# EAGLE design Logic - Copy (EAGLE 6.4)

## Sheet 1 of 6: Power Supply
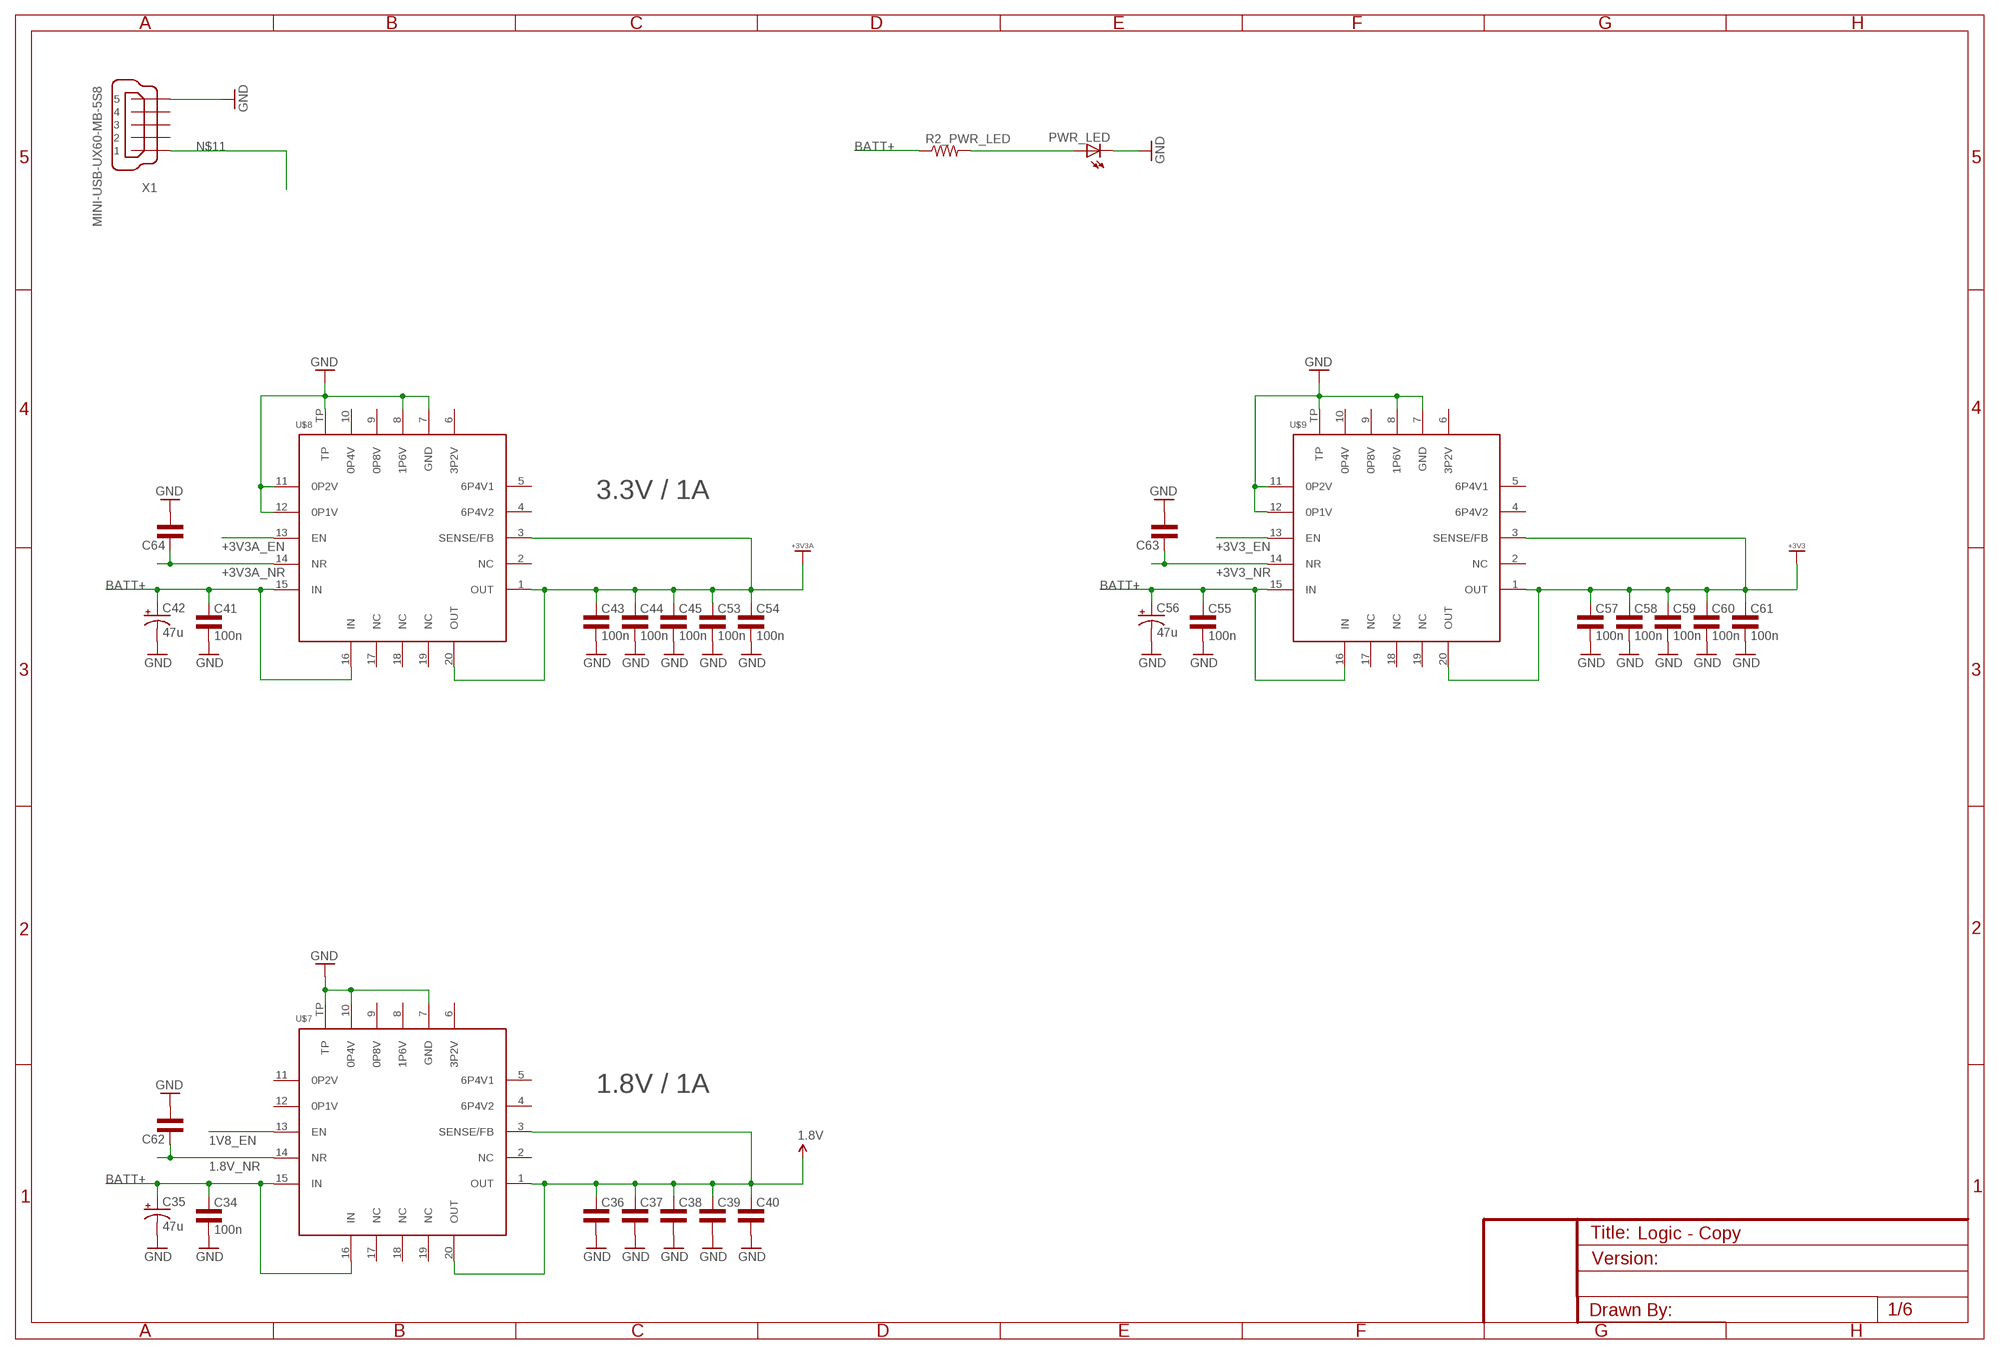
[diagram p0: schematic, sheet 1]

### Parts
C34  100n  CAP0805L3  [0805L3]
C35  47u  CPOL-USCT3528  [CT3528]
C36  CAP0805L3  [0805L3]
C37  CAP0805L3  [0805L3]
C38  CAP0805L3  [0805L3]
C39  CAP0805L3  [0805L3]
C40  CAP0805L3  [0805L3]
C41  100n  CAP0805L3  [0805L3]
C42  47u  CPOL-USCT3528  [CT3528]
C43  100n  CAP0805L3  [0805L3]
C44  100n  CAP0805L3  [0805L3]
C45  100n  CAP0805L3  [0805L3]
C53  100n  CAP0805L3  [0805L3]
C54  100n  CAP0805L3  [0805L3]
C55  100n  CAP0805L3  [0805L3]
C56  47u  CPOL-USCT3528  [CT3528]
C57  100n  CAP0805L3  [0805L3]
C58  100n  CAP0805L3  [0805L3]
C59  100n  CAP0805L3  [0805L3]
C60  100n  CAP0805L3  [0805L3]
C61  100n  CAP0805L3  [0805L3]
C62  CAP0402L3  [0402L3]
C63  CAP0402L3  [0402L3]
C64  CAP0402L3  [0402L3]
PWR_LED  LEDCHIP-LED0603  [CHIP-LED0603]
R2_PWR_LED  RESISTOR0402-RES  [0402-RES]
U$7  POWER-SUPPLY_POS_V1_TI_LDO_TPS7A4700  [POWER-SUPPLY_POS_V1_TI_LDO_VQFN-20]
U$8  POWER-SUPPLY_POS_V1_TI_LDO_TPS7A4700  [POWER-SUPPLY_POS_V1_TI_LDO_VQFN-20]
U$9  POWER-SUPPLY_POS_V1_TI_LDO_TPS7A4700  [POWER-SUPPLY_POS_V1_TI_LDO_VQFN-20]
X1  MINI-USB-UX60-MB-5S8  [UX60-MB-5S8]

### Nets
1.8V: C36.1 C37.1 C38.1 C39.1 C40.1 U$7.1(OUT) U$7.3(SENSE/FB) U$7.20(OUT) ; also sheet 6
1.8V_NR: C62.P$1 U$7.14(NR)
1V8_EN: U$7.13(EN)
+3V3: C57.1 C58.1 C59.1 C60.1 C61.1 U$9.1(OUT) U$9.3(SENSE/FB) U$9.20(OUT) ; also sheet 6
+3V3_EN: U$9.13(EN)
+3V3_NR: C63.P$1 U$9.14(NR)
+3V3A: C43.1 C44.1 C45.1 C53.1 C54.1 U$8.1(OUT) U$8.3(SENSE/FB) U$8.20(OUT) ; also sheet 6
+3V3A_EN: U$8.13(EN)
+3V3A_NR: C64.P$1 U$8.14(NR)
BATT+: C34.1 C35.+ C41.1 C42.+ C55.1 C56.+ R2_PWR_LED.1 U$7.15(IN) U$7.16(IN) U$8.15(IN) U$8.16(IN) U$9.15(IN) U$9.16(IN)
GND: C34.2 C35.- C36.2 C37.2 C38.2 C39.2 C40.2 C41.2 C42.- C43.2 C44.2 C45.2 C53.2 C54.2 C55.2 C56.- C57.2 C58.2 C59.2 C60.2 C61.2 C62.P$2 C63.P$2 C64.P$2 PWR_LED.C U$7.7(GND) U$7.10(0P4V) U$7.TP U$8.7(GND) U$8.8(1P6V) U$8.11(0P2V) U$8.12(0P1V) U$8.TP U$9.7(GND) U$9.8(1P6V) U$9.11(0P2V) U$9.12(0P1V) U$9.TP X1.5 ; also sheet 2,4,6
N$1: PWR_LED.A R2_PWR_LED.2
N$11: X1.1
Unconnected: U$7.2(NC) U$7.4(6P4V2) U$7.5(6P4V1) U$7.6(3P2V) U$7.8(1P6V) U$7.9(0P8V) U$7.11(0P2V) U$7.12(0P1V) U$7.17(NC) U$7.18(NC) U$7.19(NC) U$8.2(NC) U$8.4(6P4V2) U$8.5(6P4V1) U$8.6(3P2V) U$8.9(0P8V) U$8.10(0P4V) U$8.17(NC) U$8.18(NC) U$8.19(NC) U$9.2(NC) U$9.4(6P4V2) U$9.5(6P4V1) U$9.6(3P2V) U$9.9(0P8V) U$9.10(0P4V) U$9.17(NC) U$9.18(NC) U$9.19(NC) X1.2 X1.3 X1.4

### Notes on the sheet
- 3.3V / 1A
- 1.8V / 1A

## Sheet 2 of 6: STM32F439IIT
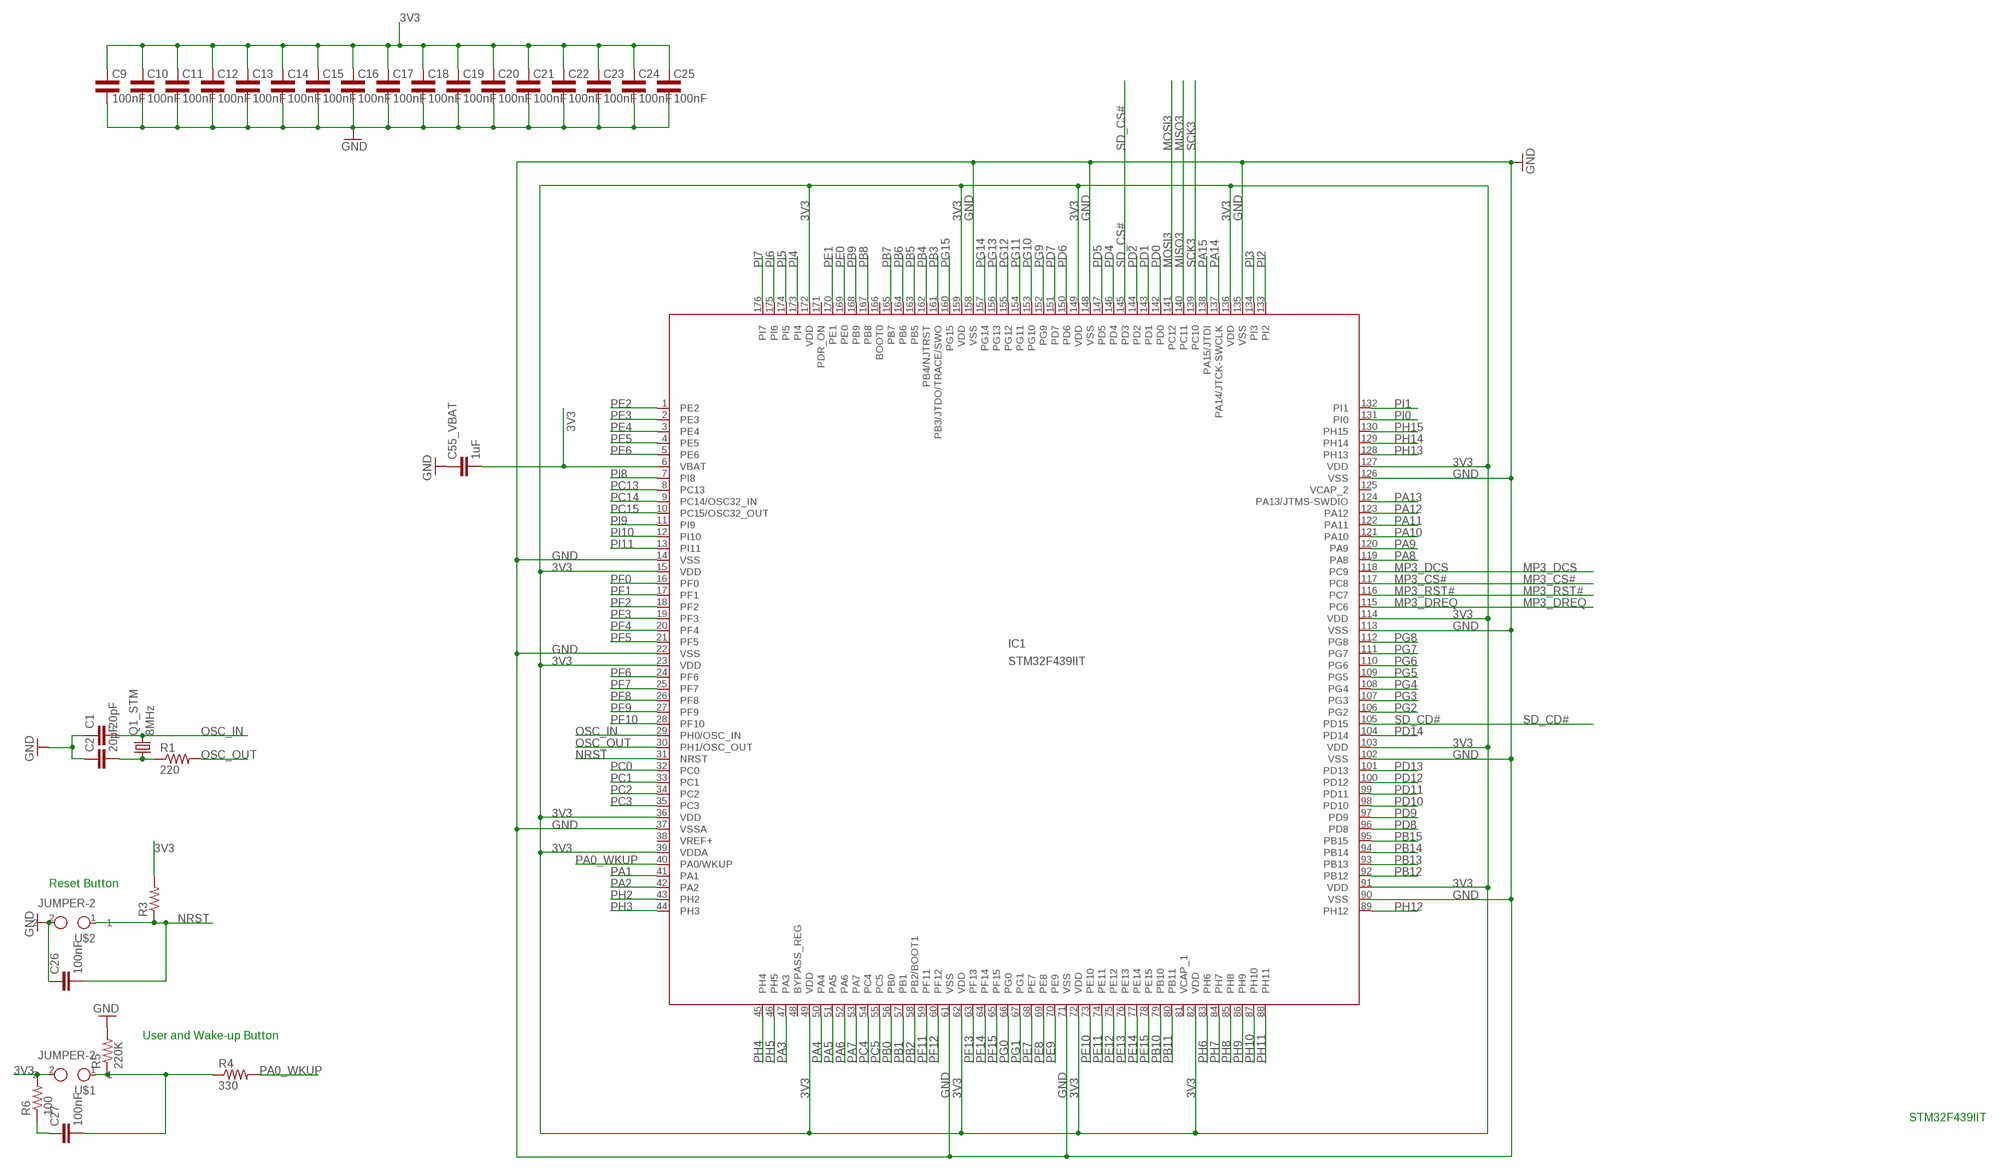
[diagram p1: schematic, sheet 2]

### Parts
C1  20pF  C-EUC0402  [C0402]
C2  20pF  C-EUC0402  [C0402]
C9  100nF  CAP0402L3  [0402L3]
C10  100nF  CAP0402L3  [0402L3]
C11  100nF  CAP0402L3  [0402L3]
C12  100nF  CAP0402L3  [0402L3]
C13  100nF  CAP0402L3  [0402L3]
C14  100nF  CAP0402L3  [0402L3]
C15  100nF  CAP0402L3  [0402L3]
C16  100nF  CAP0402L3  [0402L3]
C17  100nF  CAP0402L3  [0402L3]
C18  100nF  CAP0402L3  [0402L3]
C19  100nF  CAP0402L3  [0402L3]
C20  100nF  CAP0402L3  [0402L3]
C21  100nF  CAP0402L3  [0402L3]
C22  100nF  CAP0402L3  [0402L3]
C23  100nF  CAP0402L3  [0402L3]
C24  100nF  CAP0402L3  [0402L3]
C25  100nF  CAP0402L3  [0402L3]
C26  100nF  C-EUC0402  [C0402]
C27  100nF  C-EUC0402  [C0402]
C55_VBAT  1uF  C-EUC0402  [C0402]
IC1  STM32F439IIT  [LQFP-176]
Q1_STM  8MHz  CRYSTALCTS406  [CTS406]
R1  220  RESISTOR0402-RES  [0402-RES]
R3  RESISTOR0402-RES  [0402-RES]
R4  330  RESISTOR0402-RES  [0402-RES]
R5  220K  RESISTOR0402-RES  [0402-RES]
R6  100  RESISTOR0402-RES  [0402-RES]
U$1  JUMPER-2  [1X02]
U$2  JUMPER-2  [1X02]

### Nets
3V3: C9.P$1 C10.P$1 C11.P$1 C12.P$1 C13.P$1 C14.P$1 C15.P$1 C16.P$1 C17.P$1 C18.P$1 C19.P$1 C20.P$1 C21.P$1 C22.P$1 C23.P$1 C24.P$1 C25.P$1 C55_VBAT.2 IC1.6(VBAT) IC1.15(VDD) IC1.23(VDD) IC1.36(VDD) IC1.39(VDDA) IC1.49(VDD) IC1.62(VDD) IC1.72(VDD) IC1.82(VDD) IC1.91(VDD) IC1.103(VDD) IC1.114(VDD) IC1.127(VDD) IC1.136(VDD) IC1.149(VDD) IC1.159(VDD) IC1.172(VDD) R3.2 R6.2 U$1.2 ; also sheet 4
GND: C1.1 C2.1 C9.P$2 C10.P$2 C11.P$2 C12.P$2 C13.P$2 C14.P$2 C15.P$2 C16.P$2 C17.P$2 C18.P$2 C19.P$2 C20.P$2 C21.P$2 C22.P$2 C23.P$2 C24.P$2 C25.P$2 C26.1 C55_VBAT.1 IC1.14(VSS) IC1.22(VSS) IC1.37(VSSA) IC1.61(VSS) IC1.71(VSS) IC1.90(VSS) IC1.102(VSS) IC1.113(VSS) IC1.126(VSS) IC1.135(VSS) IC1.148(VSS) IC1.158(VSS) R5.2 U$2.2 ; also sheet 1,4,6
MISO3: IC1.140(PC11) ; also sheet 6
MOSI3: IC1.141(PC12) ; also sheet 6
MP3_CS#: IC1.117(PC8) ; also sheet 6
MP3_DCS: IC1.118(PC9) ; also sheet 6
MP3_DREQ: IC1.115(PC6) ; also sheet 6
MP3_RST#: IC1.116(PC7) ; also sheet 6
N$2: C2.2 Q1_STM.1 R1.1
N$3: C27.2 R4.1 R5.1 U$1.1
N$4: C27.1 R6.1
NRST: C26.2 IC1.31(NRST) R3.1 U$2.1
OSC_IN: C1.2 IC1.29(PH0/OSC_IN) Q1_STM.3
OSC_OUT: IC1.30(PH1/OSC_OUT) R1.2
PA0_WKUP: IC1.40(PA0/WKUP) R4.2
PA1: IC1.41(PA1)
PA2: IC1.42(PA2)
PA3: IC1.47(PA3)
PA4: IC1.50(PA4)
PA5: IC1.51(PA5)
PA6: IC1.52(PA6)
PA7: IC1.53(PA7)
PA8: IC1.119(PA8)
PA9: IC1.120(PA9)
PA10: IC1.121(PA10)
PA11: IC1.122(PA11)
PA12: IC1.123(PA12)
PA13: IC1.124(PA13/JTMS-SWDIO)
PA14: IC1.137(PA14/JTCK-SWCLK)
PA15: IC1.138(PA15/JTDI)
PB0: IC1.56(PB0)
PB1: IC1.57(PB1)
PB2: IC1.58(PB2/BOOT1)
PB3: IC1.161(PB3/JTDO/TRACE/SWO)
PB4: IC1.162(PB4/NJTRST)
PB5: IC1.163(PB5) ; also sheet 4
PB6: IC1.164(PB6) ; also sheet 4
PB7: IC1.165(PB7)
PB8: IC1.167(PB8)
PB9: IC1.168(PB9)
PB10: IC1.79(PB10)
PB11: IC1.80(PB11)
PB12: IC1.92(PB12)
PB13: IC1.93(PB13)
PB14: IC1.94(PB14)
PB15: IC1.95(PB15)
PC0: IC1.32(PC0) ; also sheet 4
PC1: IC1.33(PC1)
PC2: IC1.34(PC2)
PC3: IC1.35(PC3)
PC4: IC1.54(PC4)
PC5: IC1.55(PC5)
PC13: IC1.8(PC13)
PC14: IC1.9(PC14/OSC32_IN)
PC15: IC1.10(PC15/OSC32_OUT)
PD0: IC1.142(PD0) ; also sheet 4
PD1: IC1.143(PD1) ; also sheet 4
PD2: IC1.144(PD2)
PD4: IC1.146(PD4)
PD5: IC1.147(PD5)
PD6: IC1.150(PD6)
PD7: IC1.151(PD7)
PD8: IC1.96(PD8) ; also sheet 4
PD9: IC1.97(PD9) ; also sheet 4
PD10: IC1.98(PD10) ; also sheet 4
PD11: IC1.99(PD11)
PD12: IC1.100(PD12)
PD13: IC1.101(PD13)
PD14: IC1.104(PD14) ; also sheet 4
PE0: IC1.169(PE0) ; also sheet 4
PE1: IC1.170(PE1) ; also sheet 4
PE2: IC1.1(PE2)
PE3: IC1.2(PE3)
PE4: IC1.3(PE4)
PE5: IC1.4(PE5)
PE6: IC1.5(PE6)
PE7: IC1.68(PE7) ; also sheet 4
PE8: IC1.69(PE8) ; also sheet 4
PE9: IC1.70(PE9) ; also sheet 4
PE10: IC1.73(PE10) ; also sheet 4
PE11: IC1.74(PE11) ; also sheet 4
PE12: IC1.75(PE12) ; also sheet 4
PE13: IC1.76(PE13) ; also sheet 4
PE14: IC1.77(PE14) ; also sheet 4
PE15: IC1.78(PE15) ; also sheet 4
PF0: IC1.16(PF0) ; also sheet 4
PF1: IC1.17(PF1) ; also sheet 4
PF2: IC1.18(PF2) ; also sheet 4
PF3: IC1.19(PF3) ; also sheet 4
PF4: IC1.20(PF4) ; also sheet 4
PF5: IC1.21(PF5) ; also sheet 4
PF6: IC1.24(PF6)
PF7: IC1.25(PF7)
PF8: IC1.26(PF8)
PF9: IC1.27(PF9)
PF10: IC1.28(PF10)
PF11: IC1.59(PF11) ; also sheet 4
PF12: IC1.60(PF12) ; also sheet 4
PF13: IC1.63(PF13) ; also sheet 4
PF14: IC1.64(PF14) ; also sheet 4
PF15: IC1.65(PF15) ; also sheet 4
PG0: IC1.66(PG0) ; also sheet 4
PG1: IC1.67(PG1) ; also sheet 4
PG2: IC1.106(PG2)
PG3: IC1.107(PG3)
PG4: IC1.108(PG4) ; also sheet 4
PG5: IC1.109(PG5) ; also sheet 4
PG6: IC1.110(PG6)
PG7: IC1.111(PG7)
PG8: IC1.112(PG8) ; also sheet 4
PG9: IC1.152(PG9)
PG10: IC1.153(PG10)
PG11: IC1.154(PG11)
PG12: IC1.155(PG12)
PG13: IC1.156(PG13)
PG14: IC1.157(PG14)
PG15: IC1.160(PG15) ; also sheet 4
PH2: IC1.43(PH2)
PH3: IC1.44(PH3)
PH4: IC1.45(PH4)
PH5: IC1.46(PH5)
PH6: IC1.83(PH6)
PH7: IC1.84(PH7)
PH8: IC1.85(PH8)
PH9: IC1.86(PH9)
PH10: IC1.87(PH10)
PH11: IC1.88(PH11)
PH12: IC1.89(PH12)
PH13: IC1.128(PH13)
PH14: IC1.129(PH14)
PH15: IC1.130(PH15)
PI0: IC1.131(PI0)
PI1: IC1.132(PI1)
PI2: IC1.133(PI2)
PI3: IC1.134(PI3)
PI4: IC1.173(PI4)
PI5: IC1.174(PI5)
PI6: IC1.175(PI6)
PI7: IC1.176(PI7)
PI8: IC1.7(PI8)
PI9: IC1.11(PI9)
PI10: IC1.12(PI10)
PI11: IC1.13(PI11)
SCK3: IC1.139(PC10) ; also sheet 6
SD_CD#: IC1.105(PD15)
SD_CS#: IC1.145(PD3)
Unconnected: IC1.48(BYPASS_REG) IC1.166(BOOT0)

### Notes on the sheet
- Reset Button
- User and Wake-up Button
- STM32F439IIT

## Sheet 3 of 6: Header Pins
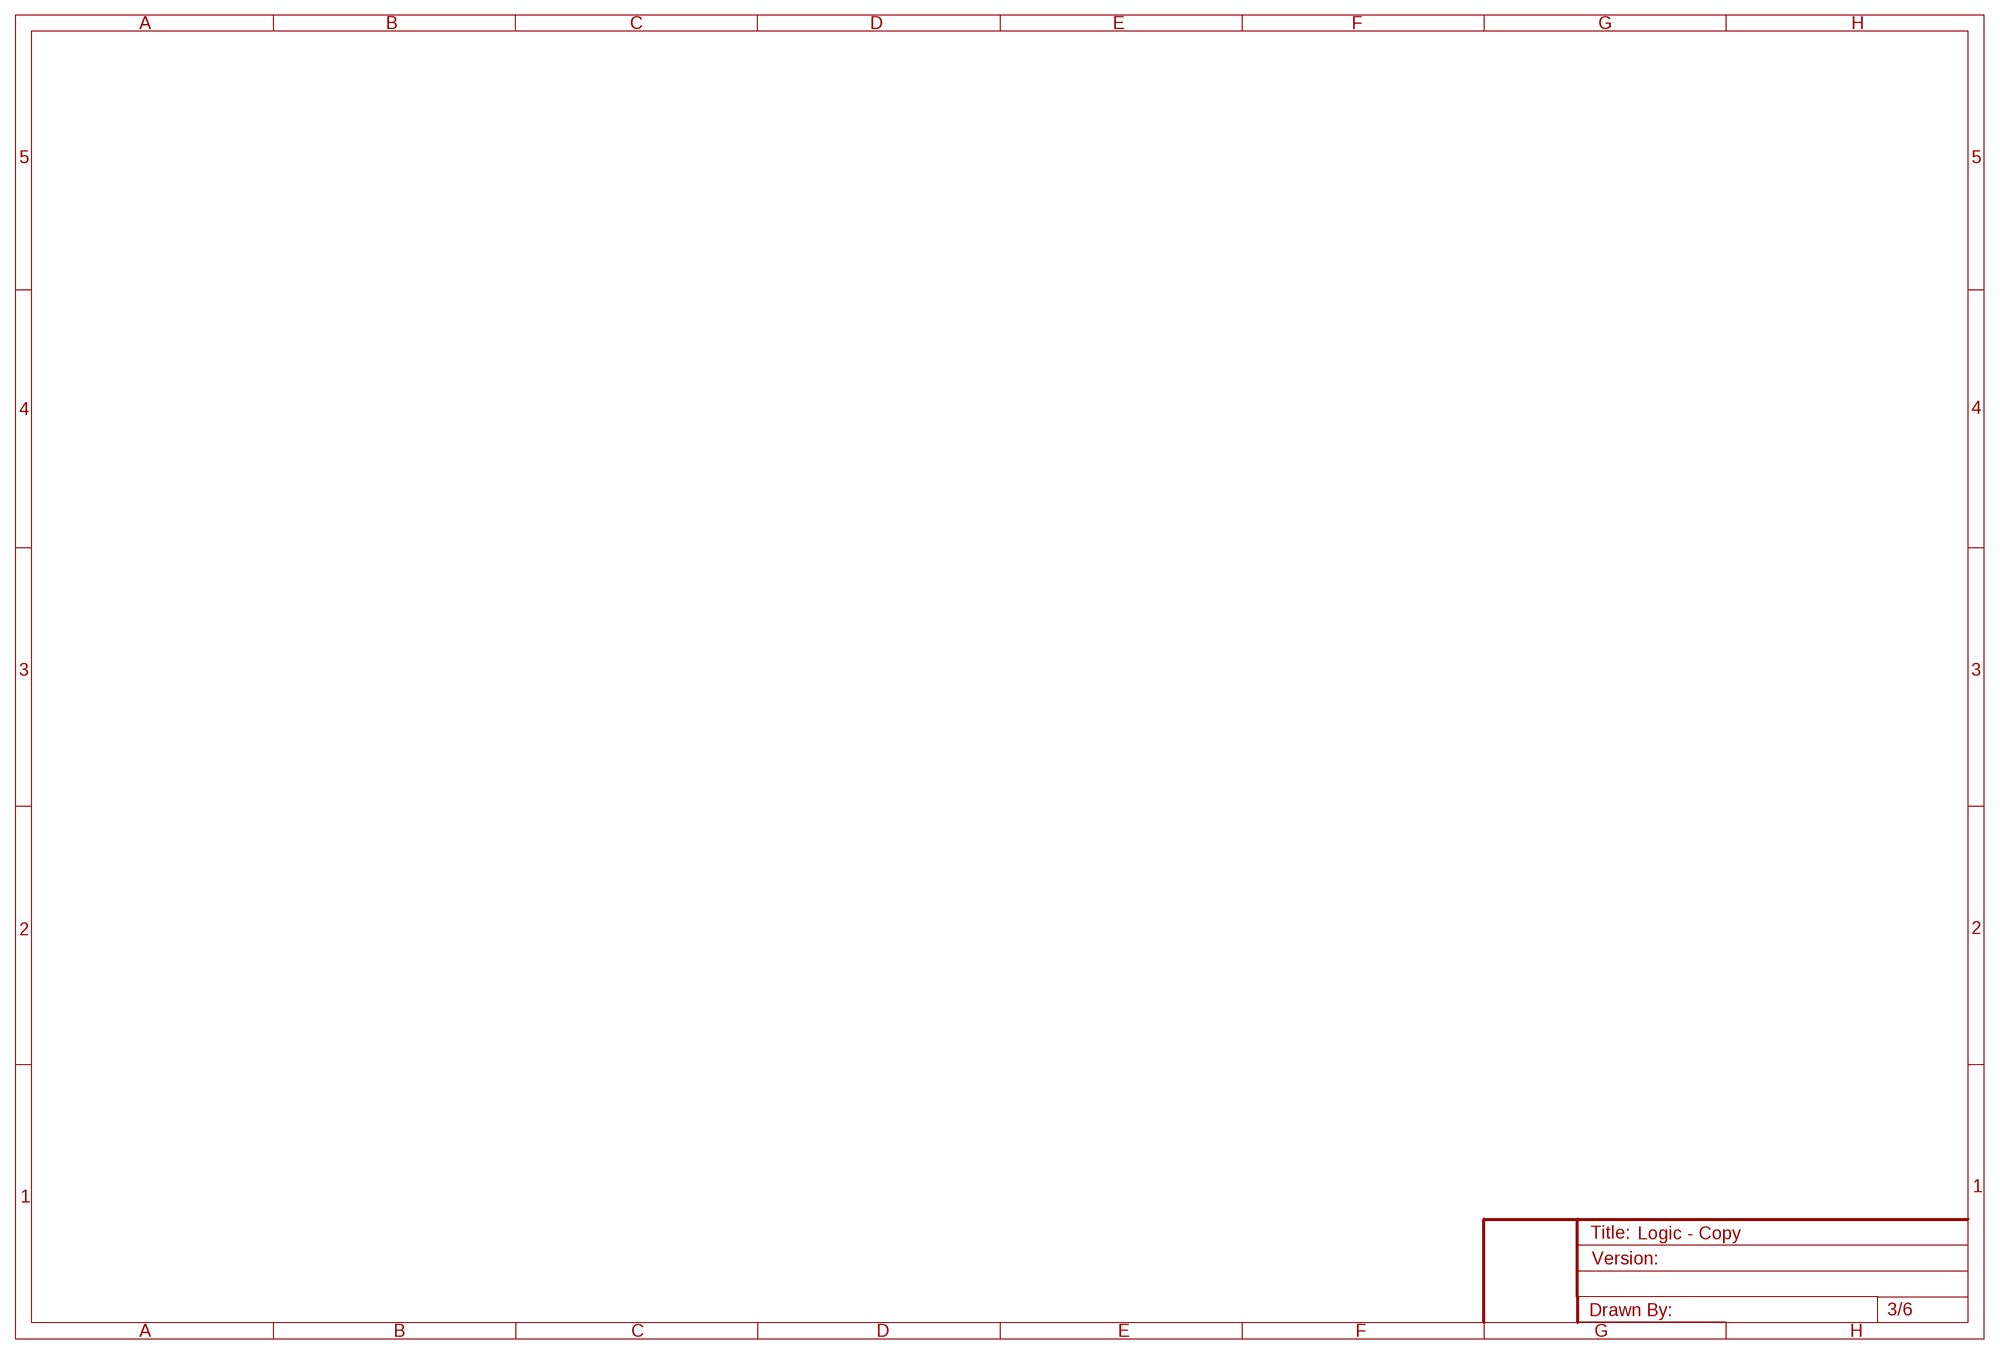
[diagram p2: schematic, sheet 3]

## Sheet 4 of 6: SRAM
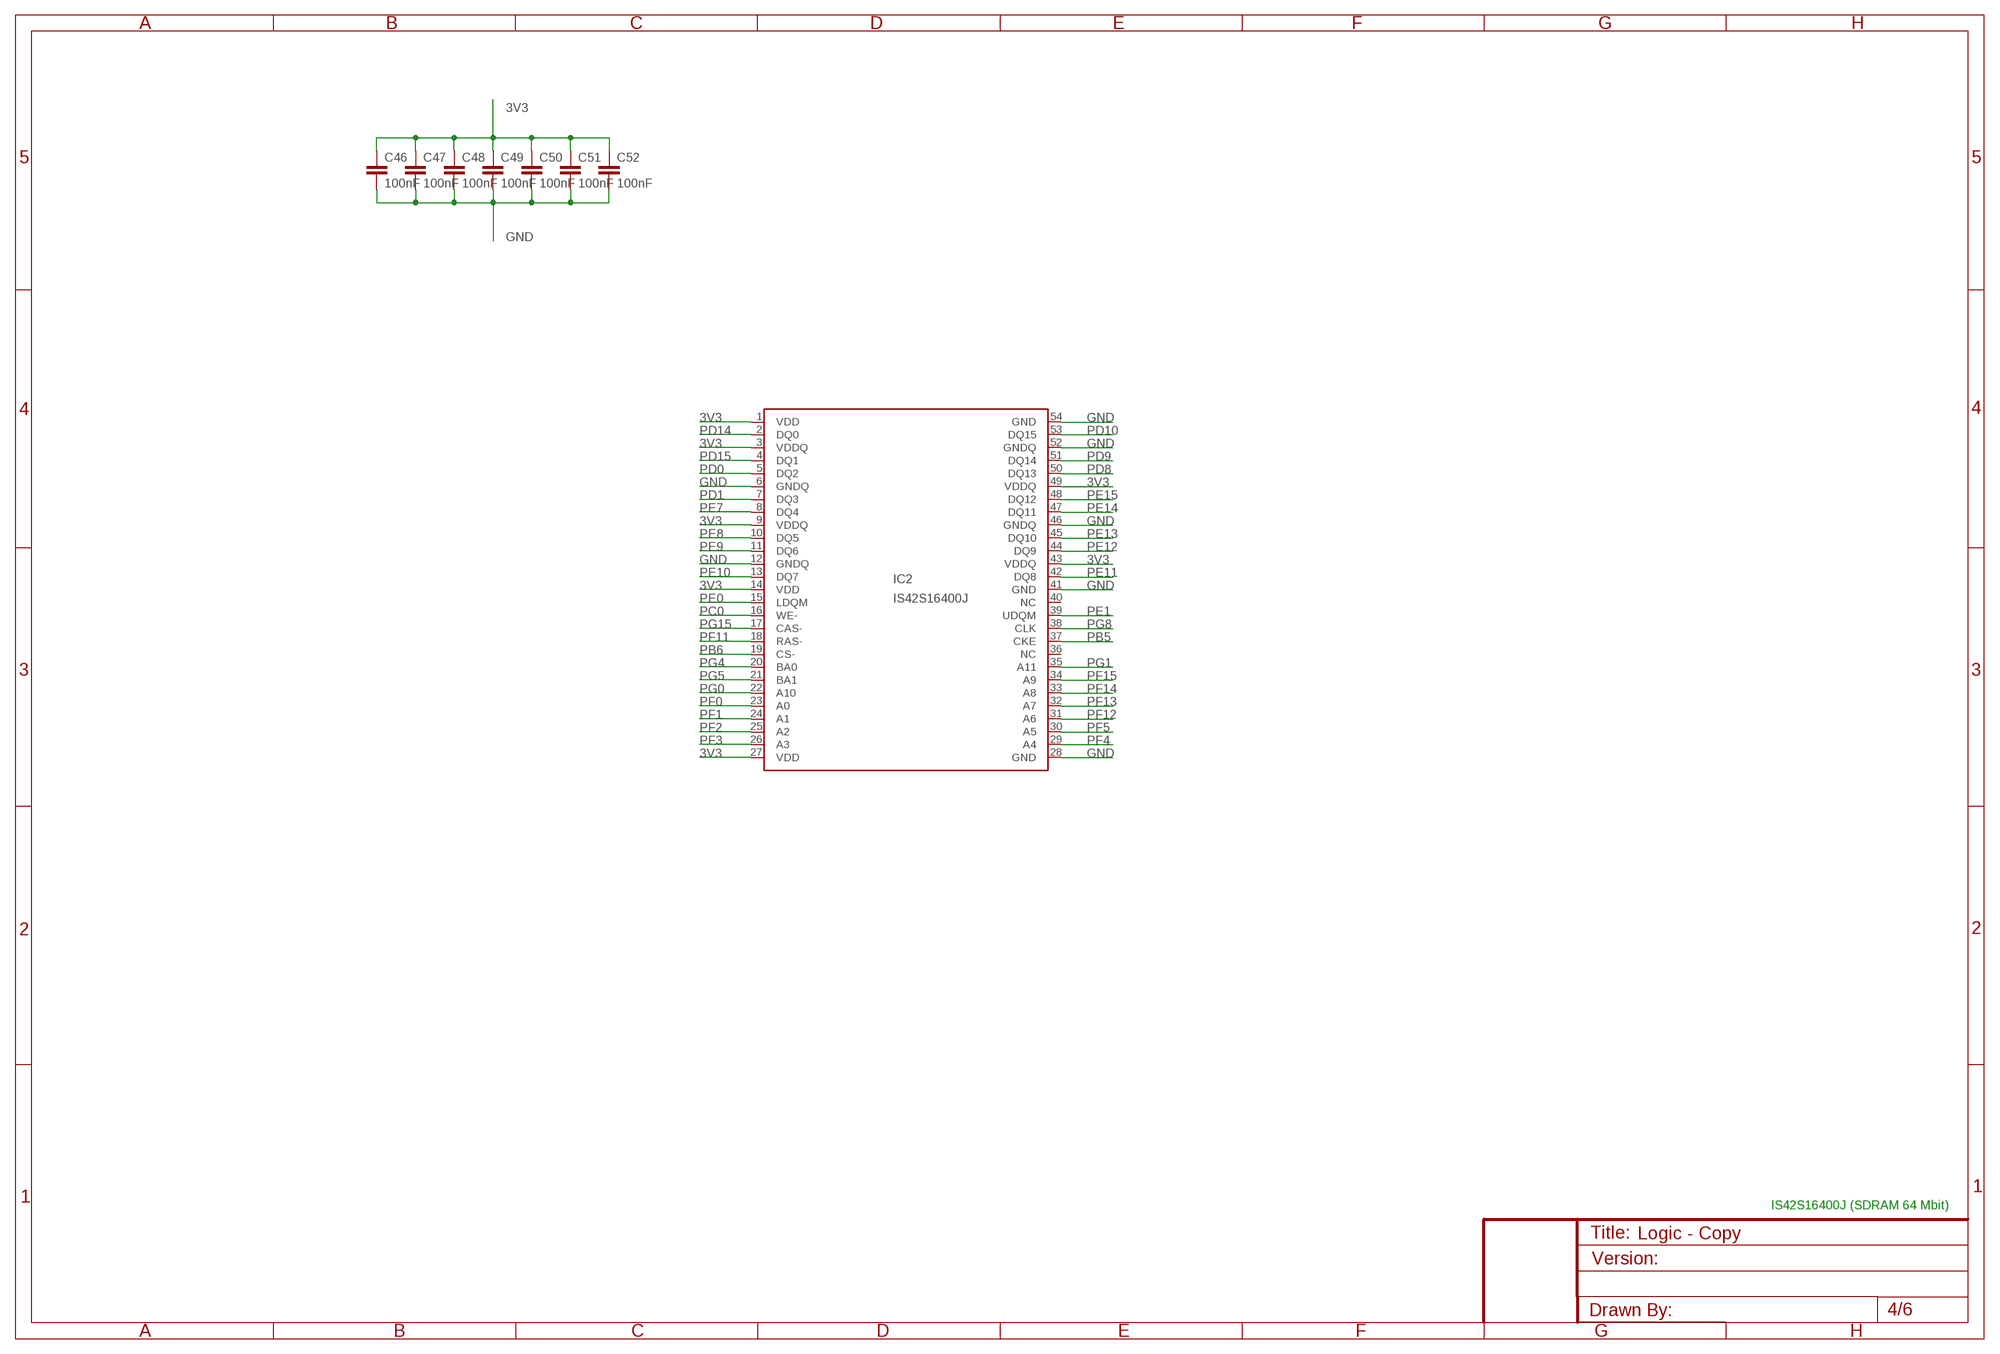
[diagram p3: schematic, sheet 4]

### Parts
C46  100nF  C-EUC0402  [C0402]
C47  100nF  C-EUC0402  [C0402]
C48  100nF  C-EUC0402  [C0402]
C49  100nF  C-EUC0402  [C0402]
C50  100nF  C-EUC0402  [C0402]
C51  100nF  C-EUC0402  [C0402]
C52  100nF  C-EUC0402  [C0402]
IC2  IS42S16400J  [TSOP-2]

### Nets
3V3: C46.1 C47.1 C48.1 C49.1 C50.1 C51.1 C52.1 IC2.1(VDD) IC2.3(VDDQ) IC2.9(VDDQ) IC2.14(VDD) IC2.27(VDD) IC2.43(VDDQ) IC2.49(VDDQ) ; also sheet 2
GND: C46.2 C47.2 C48.2 C49.2 C50.2 C51.2 C52.2 IC2.6(GNDQ) IC2.12(GNDQ) IC2.28(GND) IC2.41(GND) IC2.46(GNDQ) IC2.52(GNDQ) IC2.54(GND) ; also sheet 1,2,6
PB5: IC2.37(CKE) ; also sheet 2
PB6: IC2.19(CS-) ; also sheet 2
PC0: IC2.16(WE-) ; also sheet 2
PD0: IC2.5(DQ2) ; also sheet 2
PD1: IC2.7(DQ3) ; also sheet 2
PD8: IC2.50(DQ13) ; also sheet 2
PD9: IC2.51(DQ14) ; also sheet 2
PD10: IC2.53(DQ15) ; also sheet 2
PD14: IC2.2(DQ0) ; also sheet 2
PD15: IC2.4(DQ1)
PE0: IC2.15(LDQM) ; also sheet 2
PE1: IC2.39(UDQM) ; also sheet 2
PE7: IC2.8(DQ4) ; also sheet 2
PE8: IC2.10(DQ5) ; also sheet 2
PE9: IC2.11(DQ6) ; also sheet 2
PE10: IC2.13(DQ7) ; also sheet 2
PE11: IC2.42(DQ8) ; also sheet 2
PE12: IC2.44(DQ9) ; also sheet 2
PE13: IC2.45(DQ10) ; also sheet 2
PE14: IC2.47(DQ11) ; also sheet 2
PE15: IC2.48(DQ12) ; also sheet 2
PF0: IC2.23(A0) ; also sheet 2
PF1: IC2.24(A1) ; also sheet 2
PF2: IC2.25(A2) ; also sheet 2
PF3: IC2.26(A3) ; also sheet 2
PF4: IC2.29(A4) ; also sheet 2
PF5: IC2.30(A5) ; also sheet 2
PF11: IC2.18(RAS-) ; also sheet 2
PF12: IC2.31(A6) ; also sheet 2
PF13: IC2.32(A7) ; also sheet 2
PF14: IC2.33(A8) ; also sheet 2
PF15: IC2.34(A9) ; also sheet 2
PG0: IC2.22(A10) ; also sheet 2
PG1: IC2.35(A11) ; also sheet 2
PG4: IC2.20(BA0) ; also sheet 2
PG5: IC2.21(BA1) ; also sheet 2
PG8: IC2.38(CLK) ; also sheet 2
PG15: IC2.17(CAS-) ; also sheet 2
Unconnected: IC2.36(NC) IC2.40(NC)

### Notes on the sheet
- IS42S16400J (SDRAM 64 Mbit)

## Sheet 5 of 6: TFT & Touch
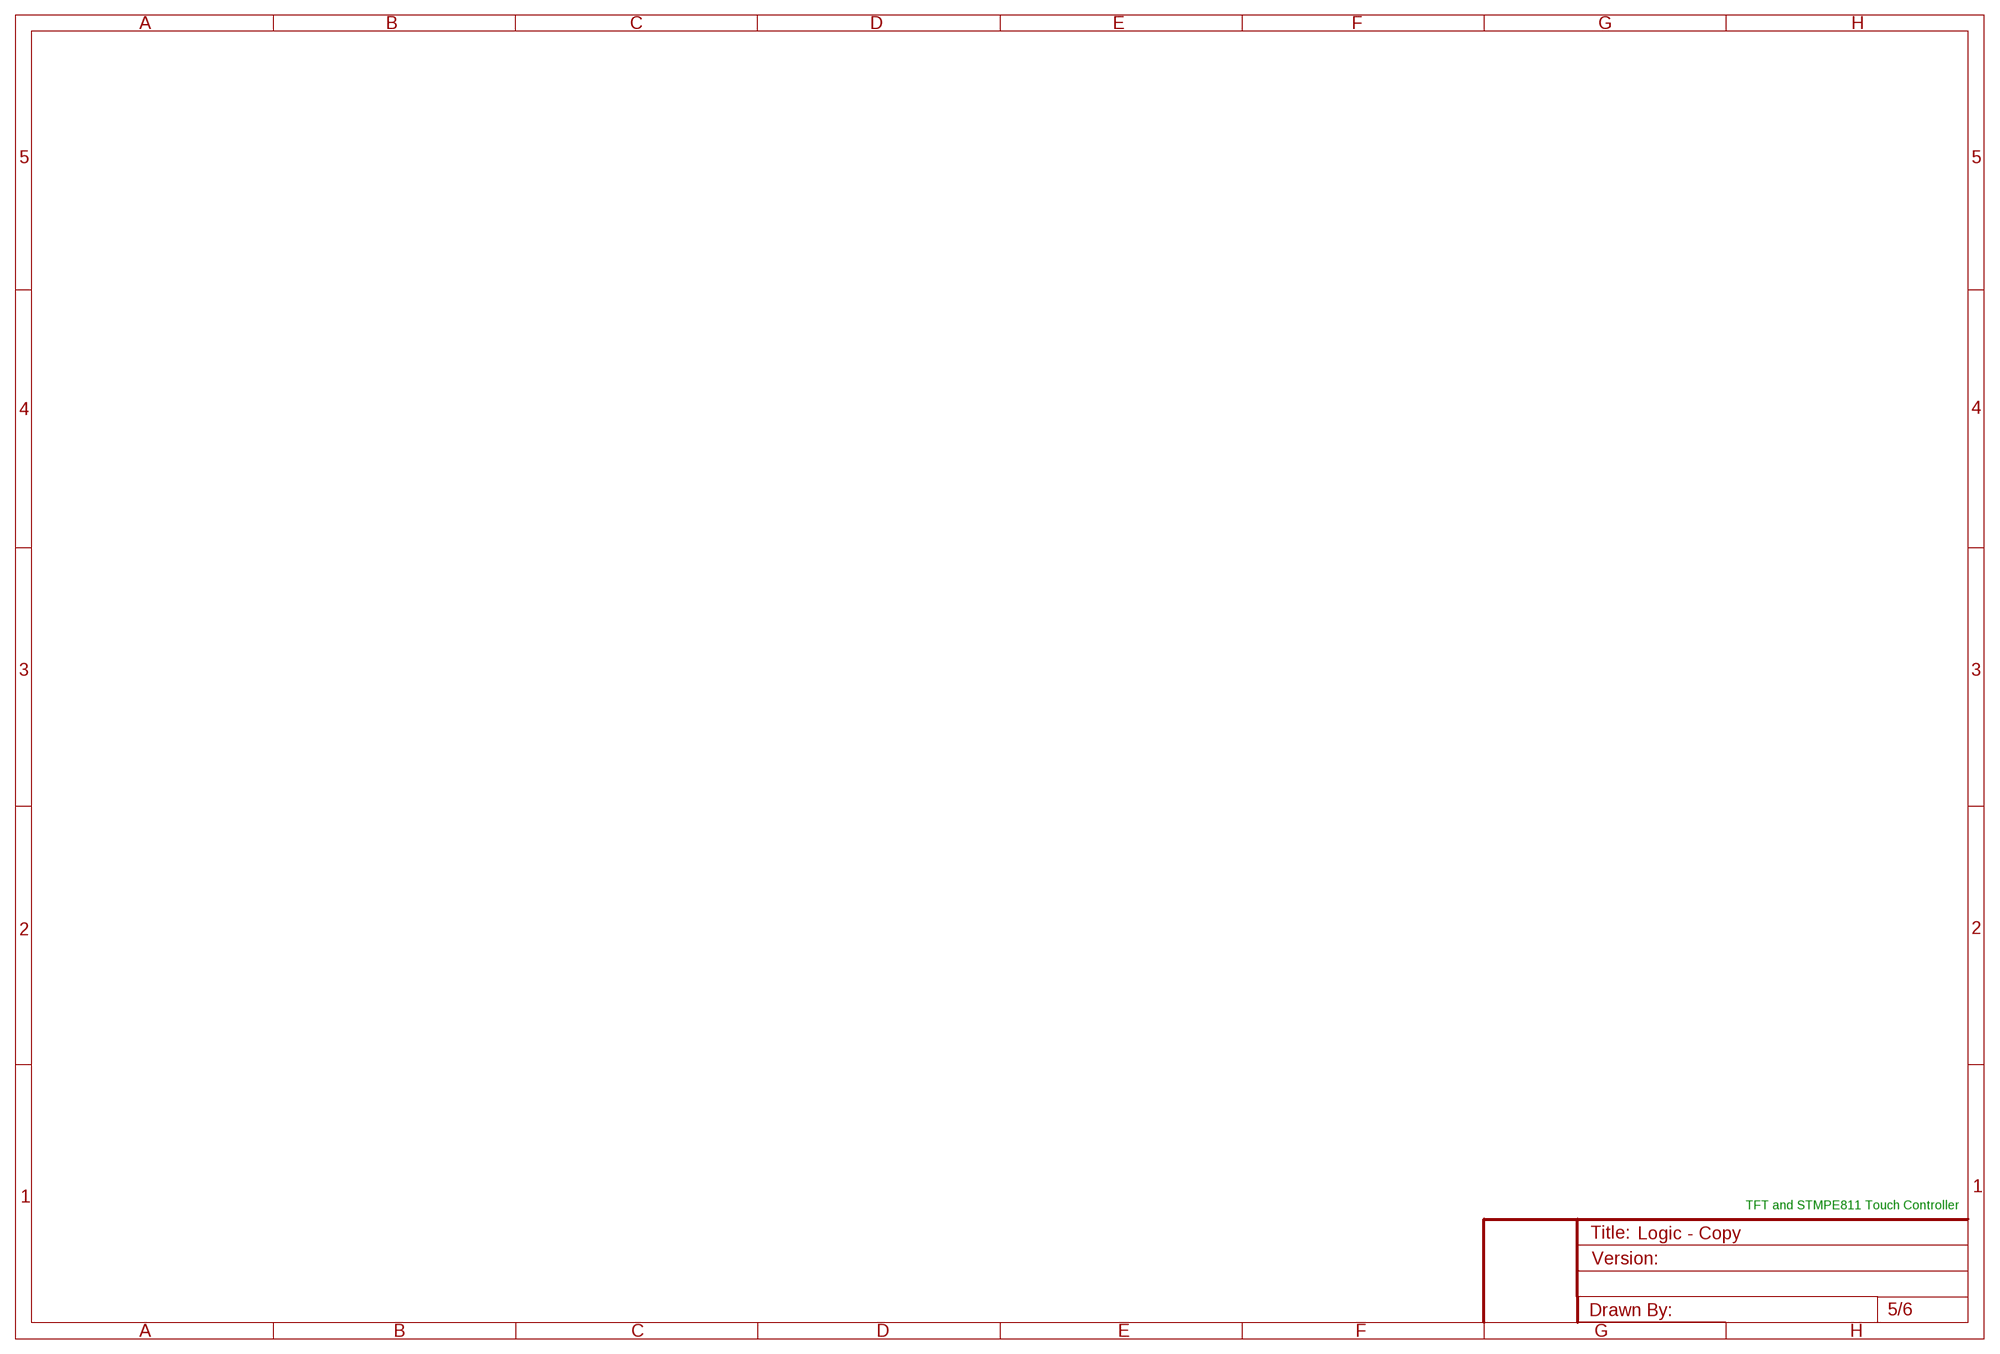
[diagram p4: schematic, sheet 5]

### Notes on the sheet
- TFT and STMPE811 Touch Controller

## Sheet 6 of 6: MP3 Codec
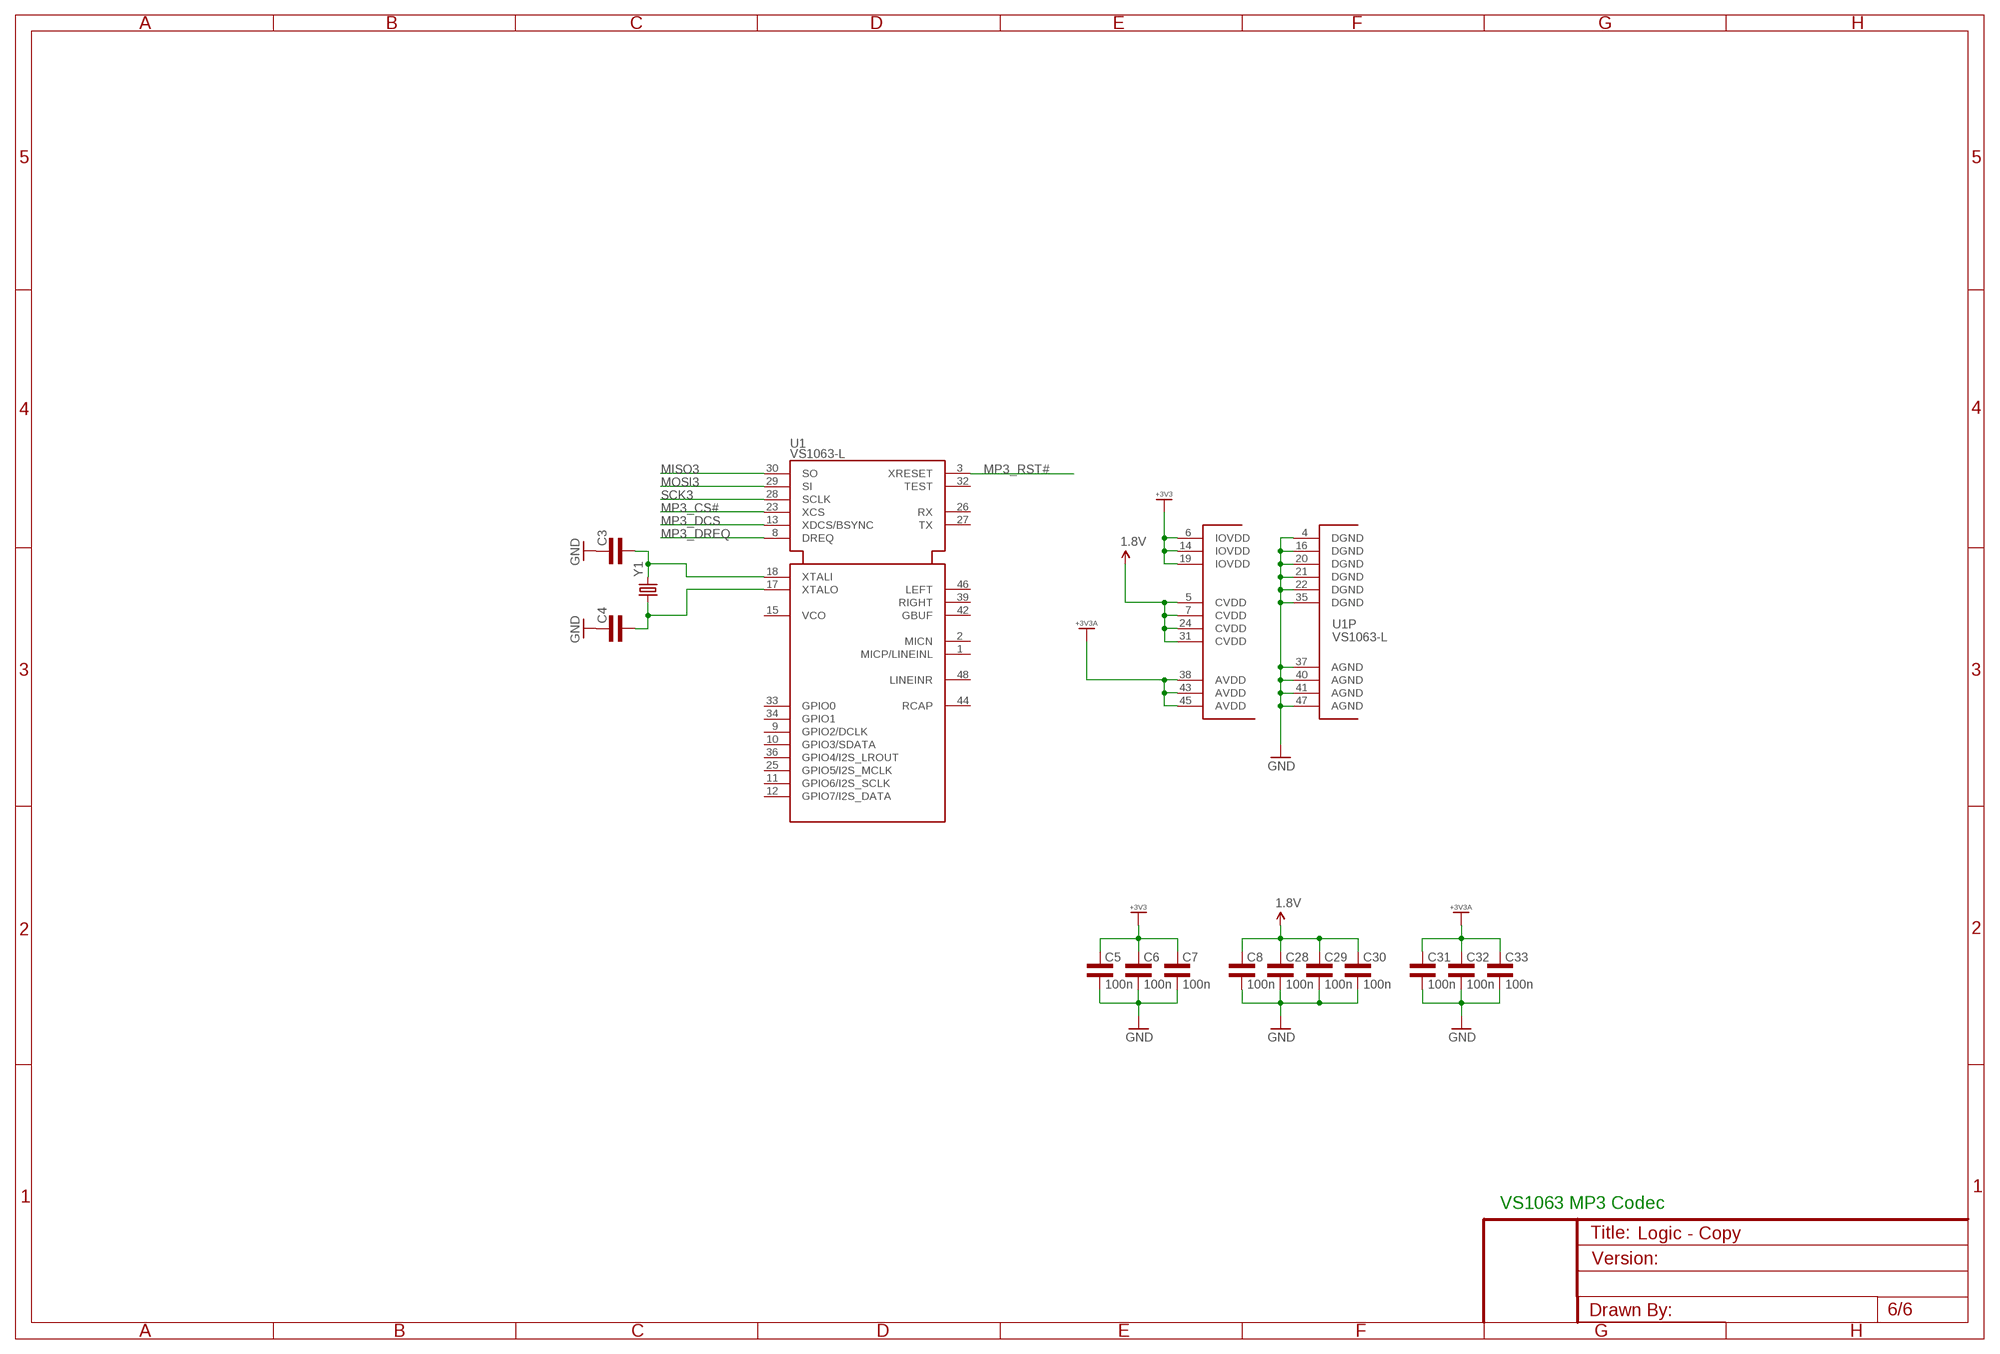
[diagram p5: schematic, sheet 6]

### Parts
C3  CAP0603L3  [0603L3]
C4  CAP0603L3  [0603L3]
C5  100n  CAP0402L3  [0402L3]
C6  100n  CAP0402L3  [0402L3]
C7  100n  CAP0402L3  [0402L3]
C8  100n  CAP0402L3  [0402L3]
C28  100n  CAP0402L3  [0402L3]
C29  100n  CAP0402L3  [0402L3]
C30  100n  CAP0402L3  [0402L3]
C31  100n  CAP0402L3  [0402L3]
C32  100n  CAP0402L3  [0402L3]
C33  100n  CAP0402L3  [0402L3]
U1  VS1063-L  [LQFP48]
Y1  CRYSTALHC49US  [HC49US]

### Nets
1.8V: C8.P$1 C28.P$1 C29.P$1 C30.P$1 U1.5(CVDD) U1.7(CVDD) U1.24(CVDD) U1.31(CVDD) ; also sheet 1
+3V3: C5.P$1 C6.P$1 C7.P$1 U1.6(IOVDD) U1.14(IOVDD) U1.19(IOVDD) ; also sheet 1
+3V3A: C31.P$1 C32.P$1 C33.P$1 U1.38(AVDD) U1.43(AVDD) U1.45(AVDD) ; also sheet 1
GND: C3.P$1 C4.P$1 C5.P$2 C6.P$2 C7.P$2 C8.P$2 C28.P$2 C29.P$2 C30.P$2 C31.P$2 C32.P$2 C33.P$2 U1.4(DGND) U1.16(DGND) U1.20(DGND) U1.21(DGND) U1.22(DGND) U1.35(DGND) U1.37(AGND) U1.40(AGND) U1.41(AGND) U1.47(AGND) ; also sheet 1,2,4
MISO3: U1.30(SO) ; also sheet 2
MOSI3: U1.29(SI) ; also sheet 2
MP3_CS#: U1.23(XCS) ; also sheet 2
MP3_DCS: U1.13(XDCS/BSYNC) ; also sheet 2
MP3_DREQ: U1.8(DREQ) ; also sheet 2
MP3_RST#: U1.3(XRESET) ; also sheet 2
N$5: C3.P$2 U1.18(XTALI) Y1.2
N$6: C4.P$2 U1.17(XTALO) Y1.1
SCK3: U1.28(SCLK) ; also sheet 2
Unconnected: U1.1(MICP/LINEINL) U1.2(MICN) U1.9(GPIO2/DCLK) U1.10(GPIO3/SDATA) U1.11(GPIO6/I2S_SCLK) U1.12(GPIO7/I2S_DATA) U1.15(VCO) U1.25(GPIO5/I2S_MCLK) U1.26(RX) U1.27(TX) U1.32(TEST) U1.33(GPIO0) U1.34(GPIO1) U1.36(GPIO4/I2S_LROUT) U1.39(RIGHT) U1.42(GBUF) U1.44(RCAP) U1.46(LEFT) U1.48(LINEINR)

### Notes on the sheet
- VS1063 MP3 Codec

## Power pins joined to a net without a drawn wire
PDR_ON: IC1.171(PDR_ON)
VCAP_1: IC1.81(VCAP_1)
VCAP_2: IC1.125(VCAP_2)
VREF+: IC1.38(VREF+)

## Library data of the parts
C1 C2 = resistor:C-EU: CAPACITOR, European symbol
C3-C25 C28-C34 C36-C41 C43-C45 C53-C55 C57-C64 = common:CAP
C26 C27 C46-C52 C55_VBAT = rcl:C-EU: CAPACITOR, European symbol
C35 C42 C56 = rcl:CPOL-US: POLARIZED CAPACITOR, American symbol
IC1 = STM32F439IIT:STM32F439IIT: edit this description Auto generated by make-symbol-device-package-bsdl.ulp Rev. 43 Source:
IC2 = IS42S16400J:IS42S16400J: edit this description Auto generated by make-symbol-device-package-bsdl.ulp Rev. 43 Source:
PWR_LED = led:LED: LED OSRAM: - CHIPLED LG R971, LG N971, LY N971, LG Q971, LY Q971, LO R971, LY R971 LH N974, LH R974 LS Q976, LO Q976, LY Q976 LO Q996 - Hyper CHIPLED LW Q18S LB Q993, LB Q99A, LB R99A - SideLED LS A670, LO A670, LY A670, LG A670, LP A670 LB A673, LV A673, LT A673, LW A673 LH A674 LY A675 LS A676, LA A676, LO A676, LY A676, LW A676 LS A679, LY A679, LG A679 - Hyper Micro SIDELED® LS Y876, LA Y876, LO Y876, LY Y876 LT Y87S - SmartLED LW L88C, LW L88S LB L89C, LB L89S, LG L890 LS L89K, LO L89K, LY L89K LS L896, LA L896, LO L896, LY L896 - TOPLED LS T670, LO T670, LY T670, LG T670, LP T670 LSG T670, LSP T670, LSY T670, LOP T670, LYG T670 LG T671, LOG T671, LSG T671 LB T673, LV T673, LT T673, LW T673 LH T674 LS T676, LA T676, LO T676, LY T676, LB T676, LH T676, LSB T676, LW T676 LB T67C, LV T67C, LT T67C, LS T67K, LO T67K, LY T67K, LW E67C LS E67B, LA E67B, LO E67B, LY E67B, LB E67C, LV E67C, LT E67C LW T67C LS T679, LY T679, LG T679 LS T770, LO T770, LY T770, LG T770, LP T770 LB T773, LV T773, LT T773, LW T773 LH T774 LS E675, LA E675, LY E675, LS T675 LS T776, LA T776, LO T776, LY T776, LB T776 LHGB T686 LT T68C, LB T68C - Hyper Mini TOPLED® LB M676 - Mini TOPLED Santana® LG M470 LS M47K, LO M47K, LY M47K Source: http://www.osram.convergy.de LUXEON: - LUMILED® LXK2-PW12-R00, LXK2-PW12-S00, LXK2-PW14-U00, LXK2-PW14-V00 LXK2-PM12-R00, LXK2-PM12-S00, LXK2-PM14-U00 LXK2-PE12-Q00, LXK2-PE12-R00, LXK2-PE12-S00, LXK2-PE14-T00, LXK2-PE14-U00 LXK2-PB12-K00, LXK2-PB12-L00, LXK2-PB12-M00, LXK2-PB14-N00, LXK2-PB14-P00, LXK2-PB14-Q00 LXK2-PR12-L00, LXK2-PR12-M00, LXK2-PR14-Q00, LXK2-PR14-R00 LXK2-PD12-Q00, LXK2-PD12-R00, LXK2-PD12-S00 LXK2-PH12-R00, LXK2-PH12-S00 LXK2-PL12-P00, LXK2-PL12-Q00, LXK2-PL12-R00 Source: www.luxeon.com KINGBRIGHT: KA-3528ASYC Source: www.kingbright.com
Q1_STM = crystal:CRYSTAL: CRYSTAL; OC_FARNELL: unknown; OC_NEWARK: unknown
R1 R2_PWR_LED R3-R6 = SparkFun-Passives:RESISTOR: Resistor Basic schematic elements and footprints for 0603, 1206, and PTH resistors.
U1 = vlsi-web:VS1063: MP3 / OGG / AAC / WMA / FLAC / G.711 / G.722 Audio Codec
U$1 U$2 = pinhead:JUMPER-2
U$7-U$9 = my_dac_amp:POWER-SUPPLY_POS_V1_TI_LDO_TPS7A4700
X1 = con-hirose:MINI-USB-: MINI USB Connector Source: http://www.hirose.co.jp/cataloge_hp/e24000019.pdf; OC_FARNELL: unknown; OC_NEWARK: unknown
Y1 = SparkFun-FreqCtrl:CRYSTAL: Various standard crystals. Proven footprints. Spark Fun Electronics SKU : COM-00534

## Board
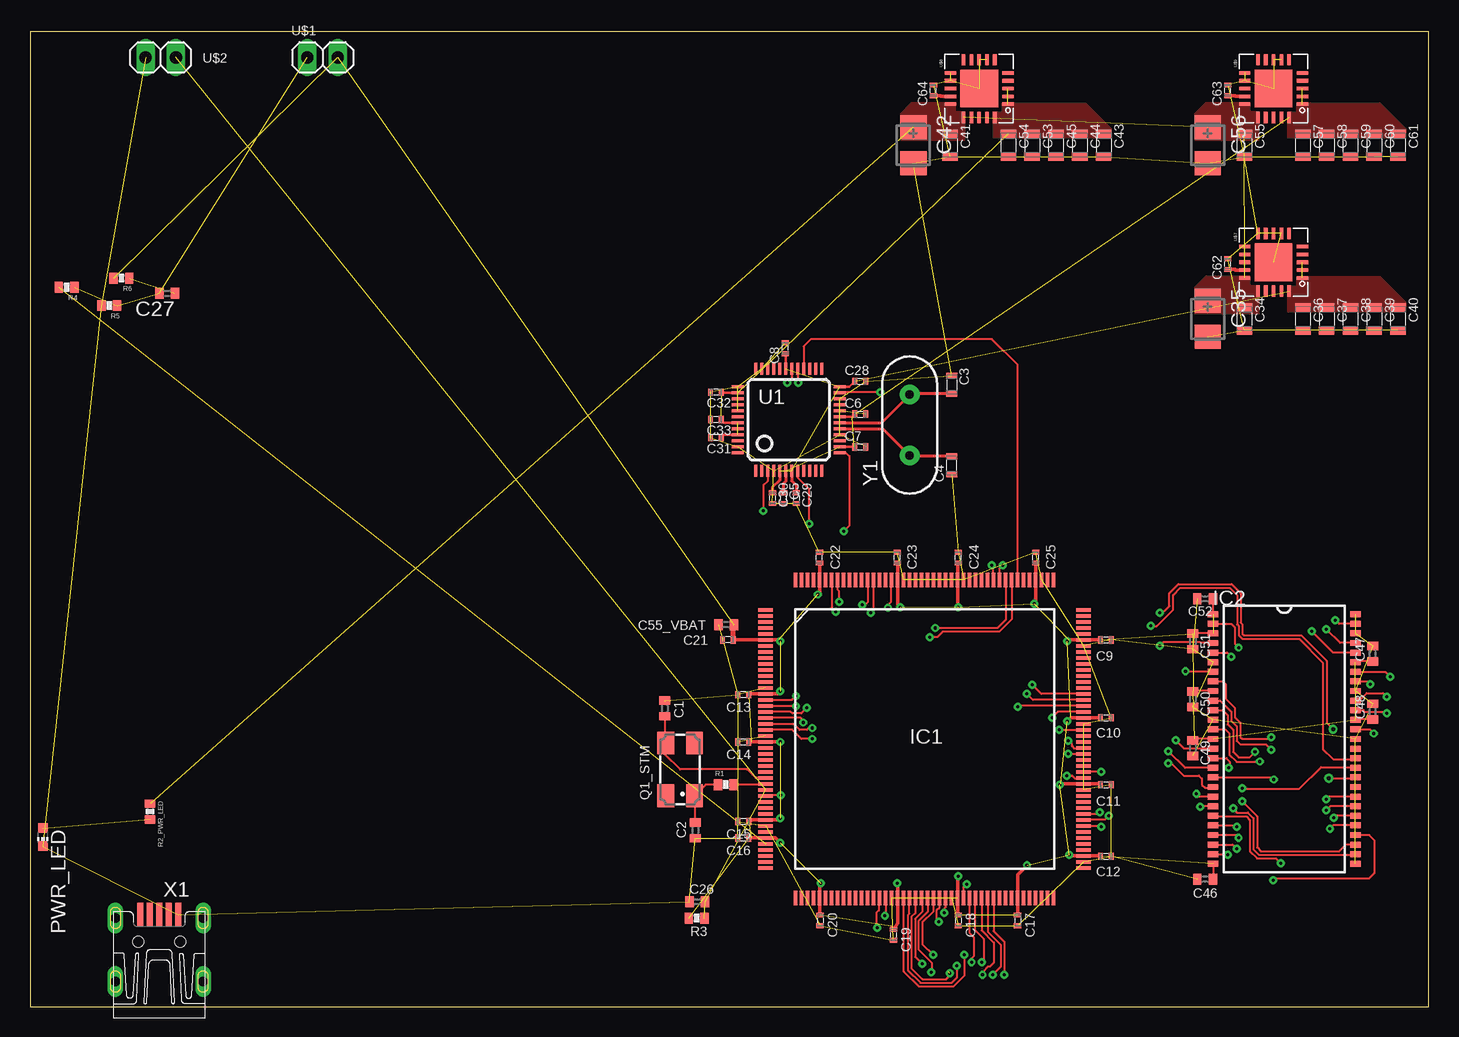
[diagram p6: board, top side]
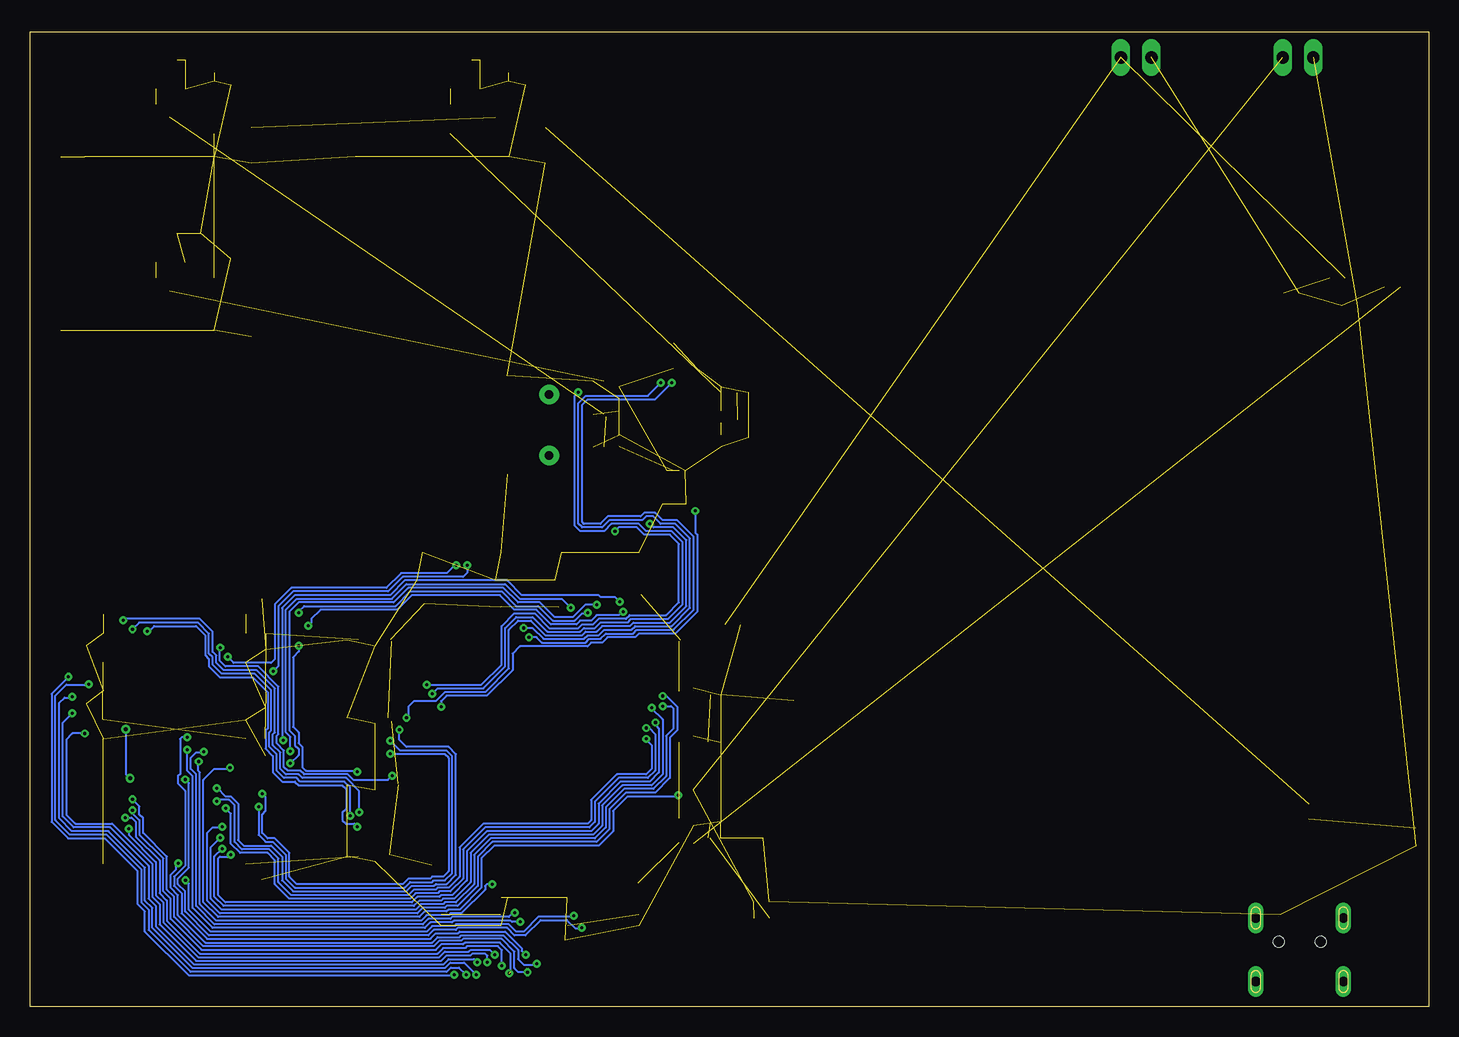
[diagram p7: board, bottom side, seen from below]

Size 116.57 x 81.23 mm. Coordinates in mm from the lower left corner, seen from the top.
Outline: 0,0 116.57,0 116.57,81.23 0,81.23 0,0
Copper layers (1*2*3*16): Top 0.035559375mm / dielectric 0.17018125mm / Route2 0.01778125mm / dielectric 47mil / Route3 0.01778125mm / dielectric 0.17018125mm / Bottom 0.035mm
Design rules "default *": minimum track width 6mil, minimum drill 10mil, track to track 6mil, track to pad 6mil, pad to pad 6mil, via to via 6mil, smd to smd 6mil, copper to edge 6mil, drill to drill 8mil, minimum pad ring 10mil, minimum via ring 8mil, stop-mask expansion 4mil, vias tented up to drill 11mil, thermal gap 10mil

### Footprints (pad centres in the part's own frame; a part is rotated, then mirrored left to right if it is on the bottom)
C0402 = smd 0.7 x 0.9: 1 -0.65,0; 2 0.65,0
0603L3 = smd 0.5 x 0.9: P$1 -0.75,0; P$2 0.75,0
0402L3 = smd 0.4 x 0.6: P$1 -0.45,0; P$2 0.45,0
0805L3 = smd 0.7 x 1.3: 1 -0.95,0; 2 0.95,0
CT3528 = smd 2 x 2.2: + -1.5,0; - 1.5,0
LQFP-176 = smd 1.2 x 0.3: 1 -13.25,10.75; 2 -13.25,10.25; 3 -13.25,9.75; 4 -13.25,9.25; 5 -13.25,8.75; 6 -13.25,8.25; 7 -13.25,7.75; 8 -13.25,7.25; 9 -13.25,6.75; 10 -13.25,6.25; 11 -13.25,5.75; 12 -13.25,5.25; 13 -13.25,4.75; 14 -13.25,4.25; 15 -13.25,3.75; 16 -13.25,3.25; 17 -13.25,2.75; 18 -13.25,2.25; 19 -13.25,1.75; 20 -13.25,1.25; 21 -13.25,0.75; 22 -13.25,0.25; 23 -13.25,-0.25; 24 -13.25,-0.75; 25 -13.25,-1.25; 26 -13.25,-1.75; 27 -13.25,-2.25; 28 -13.25,-2.75; 29 -13.25,-3.25; 30 -13.25,-3.75; 31 -13.25,-4.25; 32 -13.25,-4.75; 33 -13.25,-5.25; 34 -13.25,-5.75; 35 -13.25,-6.25; 36 -13.25,-6.75; 37 -13.25,-7.25; 38 -13.25,-7.75; 39 -13.25,-8.25; 40 -13.25,-8.75; 41 -13.25,-9.25; 42 -13.25,-9.75; 43 -13.25,-10.25; 44 -13.25,-10.75; 89 13.25,-10.75; 90 13.25,-10.25; 91 13.25,-9.75; 92 13.25,-9.25; 93 13.25,-8.75; 94 13.25,-8.25; 95 13.25,-7.75; 96 13.25,-7.25; 97 13.25,-6.75; 98 13.25,-6.25; 99 13.25,-5.75; 100 13.25,-5.25; 101 13.25,-4.75; 102 13.25,-4.25; 103 13.25,-3.75; 104 13.25,-3.25; 105 13.25,-2.75; 106 13.25,-2.25; 107 13.25,-1.75; 108 13.25,-1.25; 109 13.25,-0.75; 110 13.25,-0.25; 111 13.25,0.25; 112 13.25,0.75; 113 13.25,1.25; 114 13.25,1.75; 115 13.25,2.25; 116 13.25,2.75; 117 13.25,3.25; 118 13.25,3.75; 119 13.25,4.25; 120 13.25,4.75; 121 13.25,5.25; 122 13.25,5.75; 123 13.25,6.25; 124 13.25,6.75; 125 13.25,7.25; 126 13.25,7.75; 127 13.25,8.25; 128 13.25,8.75; 129 13.25,9.25; 130 13.25,9.75; 131 13.25,10.25; 132 13.25,10.75 | smd 0.3 x 1.2: 45 -10.75,-13.25; 46 -10.25,-13.25; 47 -9.75,-13.25; 48 -9.25,-13.25; 49 -8.75,-13.25; 50 -8.25,-13.25; 51 -7.75,-13.25; 52 -7.25,-13.25; 53 -6.75,-13.25; 54 -6.25,-13.25; 55 -5.75,-13.25; 56 -5.25,-13.25; 57 -4.75,-13.25; 58 -4.25,-13.25; 59 -3.75,-13.25; 60 -3.25,-13.25; 61 -2.75,-13.25; 62 -2.25,-13.25; 63 -1.75,-13.25; 64 -1.25,-13.25; 65 -0.75,-13.25; 66 -0.25,-13.25; 67 0.25,-13.25; 68 0.75,-13.25; 69 1.25,-13.25; 70 1.75,-13.25; 71 2.25,-13.25; 72 2.75,-13.25; 73 3.25,-13.25; 74 3.75,-13.25; 75 4.25,-13.25; 76 4.75,-13.25; 77 5.25,-13.25; 78 5.75,-13.25; 79 6.25,-13.25; 80 6.75,-13.25; 81 7.25,-13.25; 82 7.75,-13.25; 83 8.25,-13.25; 84 8.75,-13.25; 85 9.25,-13.25; 86 9.75,-13.25; 87 10.25,-13.25; 88 10.75,-13.25; 133 10.75,13.25; 134 10.25,13.25; 135 9.75,13.25; 136 9.25,13.25; 137 8.75,13.25; 138 8.25,13.25; 139 7.75,13.25; 140 7.25,13.25; 141 6.75,13.25; 142 6.25,13.25; 143 5.75,13.25; 144 5.25,13.25; 145 4.75,13.25; 146 4.25,13.25; 147 3.75,13.25; 148 3.25,13.25; 149 2.75,13.25; 150 2.25,13.25; 151 1.75,13.25; 152 1.25,13.25; 153 0.75,13.25; 154 0.25,13.25; 155 -0.25,13.25; 156 -0.75,13.25; 157 -1.25,13.25; 158 -1.75,13.25; 159 -2.25,13.25; 160 -2.75,13.25; 161 -3.25,13.25; 162 -3.75,13.25; 163 -4.25,13.25; 164 -4.75,13.25; 165 -5.25,13.25; 166 -5.75,13.25; 167 -6.25,13.25; 168 -6.75,13.25; 169 -7.25,13.25; 170 -7.75,13.25; 171 -8.25,13.25; 172 -8.75,13.25; 173 -9.25,13.25; 174 -9.75,13.25; 175 -10.25,13.25; 176 -10.75,13.25
TSOP-2 = smd 0.9 x 0.49: 1 -5.93,10.4; 2 -5.93,9.6; 3 -5.93,8.8; 4 -5.93,8; 5 -5.93,7.2; 6 -5.93,6.4; 7 -5.93,5.6; 8 -5.93,4.8; 9 -5.93,4; 10 -5.93,3.2; 11 -5.93,2.4; 12 -5.93,1.6; 13 -5.93,0.8; 14 -5.93,0; 15 -5.93,-0.8; 16 -5.93,-1.6; 17 -5.93,-2.4; 18 -5.93,-3.2; 19 -5.93,-4; 20 -5.93,-4.8; 21 -5.93,-5.6; 22 -5.93,-6.4; 23 -5.93,-7.2; 24 -5.93,-8; 25 -5.93,-8.8; 26 -5.93,-9.6; 27 -5.93,-10.4; 28 5.93,-10.4; 29 5.93,-9.6; 30 5.93,-8.8; 31 5.93,-8; 32 5.93,-7.2; 33 5.93,-6.4; 34 5.93,-5.6; 35 5.93,-4.8; 36 5.93,-4; 37 5.93,-3.2; 38 5.93,-2.4; 39 5.93,-1.6; 40 5.93,-0.8; 41 5.93,0; 42 5.93,0.8; 43 5.93,1.6; 44 5.93,2.4; 45 5.93,3.2; 46 5.93,4; 47 5.93,4.8; 48 5.93,5.6; 49 5.93,6.4; 50 5.93,7.2; 51 5.93,8; 52 5.93,8.8; 53 5.93,9.6; 54 5.93,10.4
CHIP-LED0603 = smd 0.8 x 0.8: A 0,-0.75; C 0,0.75
CTS406 = smd 1.9 x 1.4: 1 -2.2,-1.2; 2 2.2,-1.2; 3 2.2,1.2; 4 -2.2,1.2
0402-RES = smd 0.7 x 0.9: 1 -0.65,0; 2 0.65,0
LQFP48 = smd 0.25 x 1: 1 -2.75,-4.25; 2 -2.25,-4.25; 3 -1.75,-4.25; 4 -1.25,-4.25; 5 -0.75,-4.25; 6 -0.25,-4.25; 7 0.25,-4.25; 8 0.75,-4.25; 9 1.25,-4.25; 10 1.75,-4.25; 11 2.25,-4.25; 12 2.75,-4.25; 25 2.75,4.25; 26 2.25,4.25; 27 1.75,4.25; 28 1.25,4.25; 29 0.75,4.25; 30 0.25,4.25; 31 -0.25,4.25; 32 -0.75,4.25; 33 -1.25,4.25; 34 -1.75,4.25; 35 -2.25,4.25; 36 -2.75,4.25 | smd 1 x 0.25: 13 4.25,-2.75; 14 4.25,-2.25; 15 4.25,-1.75; 16 4.25,-1.25; 17 4.25,-0.75; 18 4.25,-0.25; 19 4.25,0.25; 20 4.25,0.75; 21 4.25,1.25; 22 4.25,1.75; 23 4.25,2.25; 24 4.25,2.75; 37 -4.25,2.75; 38 -4.25,2.25; 39 -4.25,1.75; 40 -4.25,1.25; 41 -4.25,0.75; 42 -4.25,0.25; 43 -4.25,-0.25; 44 -4.25,-0.75; 45 -4.25,-1.25; 46 -4.25,-1.75; 47 -4.25,-2.25; 48 -4.25,-2.75
1X02 = drill 1.016 long: 1 -1.27,0; 2 1.27,0
POWER-SUPPLY_POS_V1_TI_LDO_VQFN-20 = smd 0.3 x 0.95: 1 -1.3,-2.4; 2 -0.65,-2.4; 3 0,-2.4; 4 0.65,-2.4; 5 1.3,-2.4; 11 1.3,2.4; 12 0.65,2.4; 13 0,2.4; 14 -0.65,2.4; 15 -1.3,2.4 | smd 0.95 x 0.3: 6 2.4,-1.3; 7 2.4,-0.65; 8 2.4,0; 9 2.4,0.65; 10 2.4,1.3; 16 -2.4,1.3; 17 -2.4,0.65; 18 -2.4,0; 19 -2.4,-0.65; 20 -2.4,-1.3 | smd 3.15 x 3.15: TP 0,0
UX60-MB-5S8 = smd 2 x 0.5: 1 8.65,1.6; 2 8.65,0.8; 3 8.65,0; 4 8.65,-0.8; 5 8.65,-1.6 | drill 0.8 long: M1 3.1,-3.65; M2 3.1,3.65; M3 8.4,3.65; M4 8.4,-3.65 | hole 0.9: 6.4,-1.75; 6.4,1.75
HC49US = drill 0.7 pad 1.651: 1 -2.54,0; 2 2.54,0

### Placement (x,y rotation side)
C1  52.91,24.84 270 top
C2  55.45,14.68 90 top
C3  76.81,51.82 270 top
C4  76.81,45.11 90 top
C5  62.79,42.37 270 top
C6  69.19,49.38 0 top
C7  69.19,46.63 0 top
C8  62.94,54.86 90 top
C9  89.66,30.56 0 top
C10  89.66,24.08 0 top
C11  89.66,18.49 0 top
C12  89.66,12.52 0 top
C13  59.44,25.98 180 top
C14  59.44,22.05 180 top
C15  59.44,15.42 180 top
C16  59.44,14.05 180 top
C17  82.3,7.19 270 top
C18  77.34,7.19 270 top
C19  71.96,5.97 270 top
C20  65.84,7.19 270 top
C21  58.17,30.56 180 top
C22  65.79,37.41 90 top
C23  72.26,37.41 90 top
C24  77.34,37.41 90 top
C25  83.82,37.41 90 top
C26  55.6,8.74 0 top
C27  11.43,59.44 180 top
C28  69.19,52.12 0 top
C29  63.86,42.37 270 top
C30  61.87,42.37 270 top
C31  57.15,47.4 180 top
C32  57.15,51.21 180 top
C33  57.15,48.92 180 top
C34  101.19,57.3 270 top
C35  98.15,57.3 270 top
C36  106.07,57.3 270 top
C37  108.05,57.3 270 top
C38  110.03,57.3 270 top
C39  112.01,57.3 270 top
C40  114,57.3 270 top
C41  76.66,71.78 270 top
C42  73.61,71.78 270 top
C43  89.46,71.78 270 top
C44  87.48,71.78 270 top
C45  85.5,71.78 270 top
C46  97.92,10.62 180 top
C47  111.89,29.41 90 top
C48  111.89,24.59 90 top
C49  96.9,21.54 270 top
C50  96.9,25.6 270 top
C51  96.9,30.43 270 top
C52  97.92,33.99 180 top
C53  83.52,71.78 270 top
C54  81.53,71.78 270 top
C55  101.19,71.78 270 top
C55_VBAT  58.01,31.83 0 top
C56  98.15,71.78 270 top
C57  106.07,71.78 270 top
C58  108.05,71.78 270 top
C59  110.03,71.78 270 top
C60  112.01,71.78 270 top
C61  114,71.78 270 top
C62  99.82,61.87 90 top
C63  99.82,76.35 90 top
C64  75.29,76.35 90 top
IC1  74.55,22.3 0 top
IC2  104.52,22.3 0 top
PWR_LED  1.07,14.12 180 top
Q1_STM  54.18,19.76 90 top
R1  57.99,18.49 0 top
R2_PWR_LED  10.01,16.26 270 top
R3  55.55,7.37 180 top
R4  3.05,59.94 180 top
R5  6.6,58.42 180 top
R6  7.62,60.71 180 top
U1  63.22,48.92 0 top
U$1  24.38,79.1 0 top
U$2  10.9,79.1 180 top
U$7  103.63,62.03 90 top
U$8  79.1,76.5 90 top
U$9  103.63,76.5 90 top
X1  10.77,-1.02 90 top
Y1  73.3,48.46 90 top

### Tracks (layer width: path | path; a pad name or v marks a point on that pad's centre or on a via)
1.8V  (5 unrouted)
  Top 0.229: U1.24 68.29,51.67 C28.P$1 | U1.31 62.97,54.39 C8.P$1
  Top 0.254: U1.5 62.47,43.88 61.87,43.28 C30.P$1 | U1.7 63.47,43.82 63.86,43.43 C29.P$1
  pour Top (no thermals): 105.61,60.81 112.47,60.81 114.6,58.67 114.6,57.91 104.85,57.91 104.85,60.05 105.61,60.05
1.8V_NR
  Top 0.292: C62.P$1 100.43,61.42 100.43,61.38 U$7.14
3V3  (via drill 0.25 layers 1-4)  (26 unrouted)
  Top 0.152: IC1.39 | 87.83,12.52 IC1.91 | IC2.1 98.59,33.96 C52.1 | IC2.27 98.59,10.64 C46.1 | C48.1 110.49,23.94 IC2.43 | C47.1 110.51,28.76 IC2.49 | IC2.3 97.13,31.1 C51.1 | IC2.9 96.95,26.3 C50.1 | IC2.14 97.01,22.3 C49.1 | 71.75,6.72 C19.P$1
  Top 0.305: C9.P$1 89.01,30.55 IC1.127 86.56,30.55 v86.44,30.43 | v83.69,33.58 83.8,33.69 IC1.136 83.8,36.74 C25.P$1 | v77.34,33.27 77.3,33.32 IC1.149 77.3,36.72 C24.P$1 | C23.P$1 72.3,36.73 IC1.159 72.3,33.49 v72.52,33.27 | C22.P$1 65.8,36.75 IC1.172 65.8,34.48 v65.66,34.34 | v62.51,30.43 62.39,30.55 IC1.6 58.82,30.55 C21.P$1 | v62.51,26.26 62.3,26.05 IC1.15 60.15,26.05 C13.P$1 | v62.51,22.05 v62.5,22.05 IC1.23 60.09,22.05 C14.P$1 | C15.P$1 60.22,15.55 IC1.36 62.36,15.55 v62.51,15.7 | C16.P$1 60.09,14.05 IC1.39 62.12,14.05 v62.51,13.67 | v65.91,10.26 65.8,10.15 IC1.49 65.8,7.88 C20.P$1 | v72.26,10.26 72.3,10.23 IC1.62 72.3,6.96 C19.P$1 | C18.P$1 77.3,7.88 IC1.72 77.3,10.83 v77.34,10.87 | C17.P$1 82.3,7.84 IC1.82 82.3,11 v83.08,11.79 | v86.59,12.65 86.69,12.55 IC1.91 88.98,12.55 C12.P$1 | C11.P$1 88.95,18.55 IC1.103 85.89,18.55 v85.83,18.49 | v86.44,23.77 86.71,24.05 IC1.114 88.98,24.05 C10.P$1
  Top 0.406: C21.P$1 58.62,31.78 C55_VBAT.2
+3V3  (4 unrouted)
  Top 0.229: U1.19 68.53,49.17 C6.P$1 | U1.14 68.7,46.67 C7.P$1
  Top 0.254: U1.6 62.97,43.77 62.79,43.59 C5.P$1
  pour Top (no thermals): 105.61,75.29 112.47,75.29 114.6,73.15 114.6,72.39 104.85,72.39 104.85,74.52 105.61,74.52
+3V3_NR
  Top 0.292: C63.P$1 100.43,75.9 100.43,75.85 U$9.14
+3V3A  (4 unrouted)
  Top 0.229: U1.38 57.64,51.17 C32.P$1 | U1.43 57.85,48.67 C33.P$1 | U1.45 57.87,47.67 C31.P$1
  pour Top (no thermals): 81.08,75.29 87.93,75.29 90.07,73.15 90.07,72.39 80.31,72.39 80.31,74.52 81.08,74.52
+3V3A_NR
  Top 0.292: U$8.14 75.89,75.85 75.89,75.9 C64.P$1
BATT+  (3 unrouted)
  pour Top (no thermals): 77.11,75.29 73.46,75.29 72.54,74.37 72.54,72.24 77.88,72.24 77.88,74.52 77.11,74.52
  pour Top (no thermals): 101.65,75.29 97.99,75.29 97.08,74.37 97.08,72.24 102.41,72.24 102.41,74.52 101.65,74.52
  pour Top (no thermals): 101.65,60.81 97.99,60.81 97.08,59.89 97.08,57.76 102.41,57.76 102.41,60.05 101.65,60.05
GND  (109 unrouted)
MISO3  (via drill 0.25)
  Top 0.152: IC1.140 81.8,32.27 80.77,31.24 76.05,31.24 75.59,30.79 v74.98,30.79 | U1.30 63.47,52.34 v63.09,51.97
  Bottom 0.152: v74.98,30.79 74.37,30.79 73.91,30.33 70.26,30.33 69.95,30.63 69.04,30.63 68.58,31.09 66.29,31.09 65.99,31.39 62.94,31.39 61.27,33.07 61.27,39.17 62.64,40.54 63.86,40.54 64.47,41.15 65.38,41.15 65.68,40.84 68.43,40.84 69.04,40.23 70.41,40.23 70.56,40.39 70.56,50.14 70.1,50.6 64.47,50.6 v63.09,51.97
MOSI3  (via drill 0.25)
  Top 0.152: U1.29 63.97,52.01 v64.01,51.97 | IC1.141 81.3,32.23 80.62,31.55 v75.44,31.55
  Bottom 0.152: v75.44,31.55 74.68,31.55 73.76,30.63 70.41,30.63 70.1,30.94 69.19,30.94 68.73,31.39 66.45,31.39 66.14,31.7 63.09,31.7 61.57,33.22 61.57,39.01 62.79,40.23 64.01,40.23 64.62,40.84 65.23,40.84 65.53,40.54 68.28,40.54 68.89,39.93 70.56,39.93 70.87,40.23 70.87,50.29 70.26,50.9 65.08,50.9 v64.01,51.97
MP3_CS#  (via drill 0.25)
  Top 0.152: IC1.117 83.57,25.55 v83.06,26.06 | v70.87,51.21 67.51,51.21 U1.23
  Bottom 0.152: v83.06,26.06 82.6,26.52 78.79,26.52 76.96,28.35 76.96,31.55 76.05,32.46 74.68,32.46 73.46,31.24 70.71,31.24 70.41,31.55 69.49,31.55 69.04,32 66.75,32 66.45,32.31 63.4,32.31 62.18,33.53 62.18,38.71 63.09,39.62 65.23,39.62 65.84,40.23 68.12,40.23 68.73,39.62 70.71,39.62 71.17,40.08 71.17,50.9 v70.87,51.21
MP3_DCS  (via drill 0.25)
  Top 0.152: IC1.118 84.29,26.05 v83.52,26.82 | U1.13 67.98,46.17 68.28,45.87 68.28,40.08 v67.82,39.62
  Bottom 0.152: v83.52,26.82 78.94,26.82 77.27,28.5 77.27,31.7 76.2,32.77 74.52,32.77 73.3,31.55 70.87,31.55 70.56,31.85 69.65,31.85 69.19,32.31 66.9,32.31 66.6,32.61 63.55,32.61 62.48,33.68 62.48,38.56 63.25,39.32 65.38,39.32 65.99,39.93 67.51,39.93 v67.82,39.62
MP3_DREQ  (via drill 0.25)
  Top 0.152: IC1.115 85.66,24.55 v85.19,24.08 | v64.92,40.23 64.92,43.13 63.97,44.08 U1.8
  Bottom 0.152: v85.19,24.08 85.04,24.23 85.04,24.99 84.58,25.45 82.75,25.45 81.99,26.21 78.64,26.21 76.66,28.19 76.66,31.39 75.89,32.16 74.83,32.16 73.61,30.94 70.56,30.94 70.26,31.24 69.34,31.24 68.89,31.7 66.6,31.7 66.29,32 63.25,32 61.87,33.38 61.87,38.86 62.94,39.93 64.62,39.93 v64.92,40.23
MP3_RST#  (via drill 0.25)
  Top 0.152: v82.3,24.99 82.45,24.99 82.51,25.05 IC1.116 | U1.3 61.47,43.79 61.11,43.43 v61.11,41.3
  Bottom 0.152: v82.3,24.99 82.3,25.45 81.84,25.91 78.49,25.91 76.35,28.04 76.35,29.41 75.74,30.02 70.1,30.02 69.8,30.33 68.89,30.33 68.43,30.79 66.14,30.79 65.84,31.09 62.79,31.09 60.96,32.92 60.96,39.32 61.11,39.47 v61.11,41.3
N$1  (1 unrouted)
N$2
  Top 0.152: R1.1 56.31,18.49 Q1_STM.1 55.38,15.4
  Top 0.203: 55.72,17.22 Q1_STM.1 | 55.38,15.4 C2.2
N$3  (3 unrouted)
N$4  (1 unrouted)
N$5
  Top 0.254: U1.18 70.97,48.67 Y1.2 73.37,51.07 C3.P$2
N$6
  Top 0.254: U1.17 71.06,48.17 Y1.1 73.37,45.86 C4.P$2
NRST  (3 unrouted)
OSC_IN
  Top 0.152: IC1.29 60.48,19.05 59.77,19.76 54.18,19.76 52.91,21.03 | C1.2 52.91,22.03
  Top 0.203: 52.91,21.03 52.91,21.89 Q1_STM.3 52.91,22.03
OSC_OUT
  Top 0.152: 61.24,18.49 R1.2
  Top 0.203: 61.24,18.49 IC1.30
PA0_WKUP  (1 unrouted)
PB5  (via drill 0.25, 0.33)
  Top 0.152: IC1.163 70.31,33.05 v70.08,32.82 | v108.23,19.02 110.37,19.02 IC2.37 | v94.16,32.82 94.39,32.82 94.94,33.38 94.94,34.44 95.71,35.2 100.13,35.2 100.89,34.44 100.89,32 101.04,31.85 101.04,31.09 101.19,30.94 105.92,30.94 108.05,28.8 108.05,23.65 v108.59,23.11
  Bottom 0.152: v108.59,23.11 108.59,19.38 v108.23,19.02 | v94.16,32.82 94.16,32.94 93.73,33.38 86.11,33.38 84.89,34.59 77.27,34.59 76.05,33.38 74.22,33.38 73,32.16 71.17,32.16 70.56,32.77 70.13,32.77 v70.08,32.82
PB6  (via drill 0.25)
  Top 0.152: v69.34,33.48 69.6,33.48 69.85,33.73 69.85,35.5 IC1.164 | v94.87,20.27 95.12,20.27 96.14,19.25 97.41,19.25 97.66,19 97.66,18.49 97.92,18.24 98.53,18.24 IC2.19
  Bottom 0.152: v69.34,33.48 70.31,33.48 71.32,32.46 72.85,32.46 74.07,33.68 75.89,33.68 77.11,34.9 85.04,34.9 86.26,33.68 94.18,33.68 94.94,32.92 94.94,23.01 94.49,22.55 94.49,21.79 94.18,21.49 94.18,20.95 v94.87,20.27
PC0  (via drill 0.25)
  Top 0.152: v62.56,17.6 61.35,17.6 IC1.32 | IC2.16 99.69,20.7 99.97,20.42 99.97,19.99 v99.9,19.91
  Bottom 0.152: v99.9,19.91 100,19.81 101.19,19.81 102.11,18.9 102.11,8.69 100.89,7.47 84.12,7.47 83.67,7.92 81.84,7.92 81.69,8.08 80.77,8.08 78.94,9.91 78.94,12.34 77.88,13.41 69.19,13.41 67.97,14.63 67.97,16.31 66.75,17.53 62.64,17.53 v62.56,17.6
PD0  (via drill 0.25)
  Top 0.152: IC2.5 99.76,29.5 v100.1,29.16 | IC1.142 80.82,35.58 80.82,36.55 v81.05,36.78
  Bottom 0.152: v100.1,29.16 99.59,28.65 96.47,28.65 96.16,28.96 96.16,33.53 94.79,34.9 86.87,34.9 85.65,36.12 81.84,36.12 81.18,36.78 v81.05,36.78
PD1  (via drill 0.25)
  Top 0.152: IC2.7 96.33,27.9 v96.29,27.94 | IC1.143 80.29,35.56 80.29,36.63 v80.14,36.78
  Bottom 0.152: v80.14,36.78 80.14,36.14 80.47,35.81 85.5,35.81 86.72,34.59 94.64,34.59 95.86,33.38 95.86,28.37 v96.29,27.94
PD8  (via drill 0.25)
  Top 0.152: IC2.50 108.6,29.5 v106.81,31.29 | IC1.96 87.81,15.06 89.21,15.06 v89.28,14.99
  Bottom 0.152: v106.81,31.29 106.63,31.29 106.22,31.7 102.72,31.7 101.96,30.94 101.96,29.26 101.65,28.96 101.65,28.35 100.74,27.43 97.99,27.43 96.77,26.21 96.77,23.16 96.93,23.01 96.93,21.49 96.32,20.88 96.32,19.51 95.56,18.74 94.49,18.74 94.18,18.44 90.53,18.44 90.22,18.14 90.22,16.46 90.53,16.15 90.53,15.54 90.22,15.24 89.53,15.24 v89.28,14.99
PD9  (via drill 0.25)
  Top 0.152: IC2.51 109.17,30.3 v108.03,31.45 | IC1.97 87.84,15.6 89.59,15.6 v89.89,15.9
  Bottom 0.152: v89.89,15.9 89.89,18.26 90.37,18.74 94.03,18.74 94.34,19.05 95.4,19.05 96.01,19.66 96.01,21.03 96.62,21.64 96.62,22.86 96.47,23.01 96.47,26.37 97.84,27.74 100.58,27.74 101.35,28.5 101.35,29.11 101.65,29.41 101.65,31.09 102.56,32 107.47,32 v108.03,31.45
PD10  (via drill 0.25)
  Top 0.152: IC2.53 109.09,31.9 v108.79,32.21 | IC1.98 88.97,16.05 v89.13,16.2
  Bottom 0.152: v89.13,16.2 89.13,17.96 90.22,19.05 93.88,19.05 94.18,19.35 95.25,19.35 95.71,19.81 95.71,21.18 96.32,21.79 96.32,22.71 96.16,22.86 96.16,26.52 97.69,28.04 100.43,28.04 101.04,28.65 101.04,29.26 101.35,29.57 101.35,31.24 102.41,32.31 108.69,32.31 v108.79,32.21
PD14  (via drill 0.25)
  Top 0.152: IC2.2 100.1,31.9 100.41,31.6 100.41,30.23 v100.71,29.92 | v86.38,19.25 86.84,19.25 87.07,19.02 87.77,19.02 IC1.104
  Bottom 0.152: v100.71,29.92 100.74,29.9 100.74,28.8 100.28,28.35 97.54,28.35 95.86,26.67 95.86,22.71 96.01,22.55 96.01,21.95 95.4,21.34 95.4,19.96 95.1,19.66 94.03,19.66 93.73,19.35 90.07,19.35 89.61,18.9 86.74,18.9 v86.38,19.25
PD15  (via drill 0.25)
  Top 0.152: IC2.4 97.59,30.3 97.51,30.38 94.46,30.38 v94.16,30.07 | v89.28,19.56 87.81,19.56
  Bottom 0.152: 89.46,19.66 89.36,19.56 v89.28,19.56 89.38,19.66 93.57,19.66 93.88,19.96 93.88,21.64 94.18,21.95 94.18,22.86 94.64,23.32 94.64,29.11 94.16,29.59 v94.16,30.07
PE0  (via drill 0.25)
  Top 0.152: IC2.15 96.18,21.5 v95.48,22.2 | v67.44,33.73 67.44,34.62 67.31,34.75 67.31,35.54 IC1.169
  Bottom 0.152: 67.46,33.73 v67.44,33.73 67.84,34.14 69.04,34.14 69.19,34.29 75.59,34.29 76.81,35.51 85.34,35.51 86.56,34.29 94.49,34.29 95.56,33.22 95.56,22.28 v95.48,22.2
PE1  (via drill 0.25)
  Top 0.152: IC2.39 110.38,20.62 108.59,20.62 107.75,21.46 107.75,28.65 105.77,30.63 101.04,30.63 100.74,30.94 100.74,31.7 100.58,31.85 100.58,34.29 99.97,34.9 95.86,34.9 95.25,34.29 95.25,33.07 93.88,31.7 93.57,31.7 93.52,31.75 v93.4,31.75 | IC1.170 66.8,33.25 v67.13,32.92
  Bottom 0.152: v93.4,31.75 93.12,32.03 93.12,32.31 92.35,33.07 85.95,33.07 84.73,34.29 77.42,34.29 76.2,33.07 74.37,33.07 73.15,31.85 71.02,31.85 70.71,32.16 69.8,32.16 69.34,32.61 67.51,32.61 67.21,32.92 v67.13,32.92
PE7  (via drill 0.25)
  Top 0.152: IC2.8 99.42,27.1 99.64,26.87 99.64,25.65 100.41,24.89 100.41,24.13 100.86,23.67 100.86,22.45 101.02,22.3 103.3,22.3 v103.45,22.45 | IC1.68 75.26,9.01 75.26,7.9 74.37,7.01 74.37,5.21 v75.26,4.32 75.11,4.47
  Bottom 0.152: v103.45,22.45 103.91,22.45 104.06,22.3 104.06,19.38 104.24,19.2 104.24,18.59 103.63,17.98 103.63,11.74 104.55,10.82 104.55,10.06 103.94,9.45 103.94,7.77 101.8,5.64 83.21,5.64 82.75,6.1 80.92,6.1 80.77,6.25 76.96,6.25 75.59,4.88 75.59,4.65 v75.26,4.32
PE8  (via drill 0.25)
  Top 0.152: IC2.10 99.19,25.5 100.1,24.59 100.1,23.83 100.56,23.37 100.56,22.15 100.86,21.84 103,21.84 v103.45,21.39 | IC1.69 75.79,8.28 75.56,8.05 75.56,7.21 v75.72,7.06
  Bottom 0.152: v75.72,7.06 76.4,7.06 76.5,7.16 81.23,7.16 81.38,7.01 83.21,7.01 83.67,6.55 101.35,6.55 103.02,8.23 103.02,19.2 103.48,19.66 103.48,21.36 v103.45,21.39
PE9  (via drill 0.25)
  Top 0.152: IC2.11 99.38,24.7 99.8,24.28 99.8,23.52 100.25,23.06 100.25,21.23 100.71,20.78 101.62,20.78 v102.08,21.23 | v76.17,7.82 76.17,8.13 76.33,8.28 76.33,9.02 IC1.70
  Bottom 0.152: v76.17,7.82 76.3,7.82 76.66,7.47 81.38,7.47 81.53,7.31 83.36,7.31 83.82,6.86 101.19,6.86 102.72,8.38 102.72,19.35 103.18,19.81 103.18,20.73 102.72,21.18 102.13,21.18 v102.08,21.23
PE10  (via drill 0.25)
  Top 0.152: IC2.13 99.61,23.1 99.95,22.76 99.95,21.01 100.56,20.4 102.46,20.4 v102.49,20.42 | IC1.73 77.8,9.96 v78.05,10.21
  Bottom 0.152: v78.05,10.21 78.49,10.21 78.64,10.06 78.64,9.75 80.62,7.77 81.53,7.77 81.69,7.62 83.52,7.62 83.97,7.16 101.04,7.16 102.41,8.53 102.41,19.51 102.56,19.66 102.56,20.34 v102.49,20.42
PE11  (via drill 0.25)
  Top 0.152: IC2.42 111.65,23.1 v111.99,22.76 | IC1.74 78.31,9.04 78.31,6.12 78.64,5.79 78.64,4.19 78.46,4.01 v78.46,3.71
  Bottom 0.152: v111.99,22.76 113.03,22.76 113.54,22.25 113.54,16 112.78,15.24 109.73,15.24 106.38,11.89 106.38,9.14 105.77,8.53 105.77,6.86 102.72,3.81 82.3,3.81 81.84,4.27 79.86,4.27 79.7,4.42 78.64,4.42 78.46,4.24 v78.46,3.71
PE12  (via drill 0.25)
  Top 0.152: IC2.44 111.11,24.7 111.23,24.59 112.9,24.59 v113.06,24.44 | IC1.75 78.77,9.02 78.77,6.35 79.48,5.64 79.48,3.89 v79.3,3.71
  Bottom 0.152: v113.06,24.44 113.84,23.65 113.84,15.85 112.93,14.94 109.88,14.94 106.68,11.74 106.68,8.99 106.07,8.38 106.07,6.71 102.87,3.51 82.14,3.51 81.69,3.96 79.55,3.96 v79.3,3.71
PE13  (via drill 0.25)
  Top 0.152: IC2.45 110.77,25.5 111.38,26.11 112.75,26.11 v113.06,25.81 | IC1.76 | IC1.76 79.3,6.35 80.31,5.33 80.31,3.66 80.01,3.35 79.86,3.35 79.38,2.87 v79.38,2.64
  Bottom 0.152: v113.06,25.81 113.11,25.76 113.69,25.76 114.15,25.3 114.15,15.7 113.08,14.63 110.03,14.63 106.99,11.58 106.99,8.84 106.38,8.23 106.38,6.55 103.02,3.2 81.99,3.2 81.53,3.66 80.39,3.66 v79.38,2.64
PE14  (via drill 0.25)
  Top 0.152: IC2.47 111.46,27.1 v111.68,26.87 | IC1.77 79.83,9.02 79.83,6.22 80.92,5.13 80.92,3.35 v80.21,2.64
  Bottom 0.152: v111.68,26.87 111.74,26.82 113.54,26.82 114.45,25.91 114.45,15.54 113.23,14.33 110.19,14.33 107.29,11.43 107.29,8.69 106.68,8.08 106.68,6.4 103.18,2.9 81.84,2.9 81.48,3.25 80.82,3.25 v80.21,2.64
PE15  (via drill 0.25)
  Top 0.152: IC2.48 112.94,27.9 v113.36,27.48 | IC1.78 80.3,6.29 81.2,5.38 v81.2,2.64
  Bottom 0.152: v113.36,27.48 113.36,27.46 114.76,26.06 114.76,15.39 113.39,14.02 110.34,14.02 107.59,11.28 107.59,8.53 106.99,7.92 106.99,6.25 103.33,2.59 81.25,2.59 v81.2,2.64
PF0  (via drill 0.25)
  Top 0.152: IC2.23 100.44,15.1 v100.56,14.99 | IC1.16 61.33,25.58 63.53,25.58 v63.83,25.88
  Bottom 0.152: v63.83,25.88 63.53,25.88 62.64,24.99 62.64,23.01 63.25,22.4 63.25,19.05 64.47,17.83 66.9,17.83 68.28,16.46 68.28,14.78 69.34,13.72 78.03,13.72 79.25,12.5 79.25,10.06 80.92,8.38 81.84,8.38 81.99,8.23 83.82,8.23 84.28,7.77 100.74,7.77 101.8,8.84 101.8,14.48 101.35,14.94 100.61,14.94 v100.56,14.99
PF1  (via drill 0.25)
  Top 0.152: IC2.24 100.48,14.3 v100.71,14.07 | v63.83,25.04 IC1.17
  Bottom 0.152: v63.83,25.04 63.14,25.04 62.94,24.84 62.94,23.16 63.55,22.55 63.55,19.2 64.62,18.14 67.06,18.14 68.58,16.61 68.58,14.94 69.49,14.02 78.18,14.02 79.55,12.65 79.55,10.21 81.08,8.69 81.99,8.69 82.14,8.53 83.97,8.53 84.43,8.08 100.58,8.08 101.5,8.99 101.5,13.28 v100.71,14.07
PF2  (via drill 0.25)
  Top 0.152: IC2.25 100.22,13.5 v100.56,13.16 | v64.75,24.89 64.29,24.44 63.53,24.44 63.37,24.59 61.34,24.59 IC1.18
  Bottom 0.152: v64.75,24.89 64.75,24.82 63.86,23.93 63.86,19.35 64.77,18.44 67.21,18.44 68.89,16.76 68.89,15.09 69.65,14.33 78.33,14.33 79.86,12.8 79.86,10.36 81.23,8.99 82.14,8.99 82.3,8.84 84.12,8.84 84.58,8.38 100.43,8.38 101.19,9.14 101.19,12.52 v100.56,13.16
PF3  (via drill 0.25)
  Top 0.152: v64.44,23.67 64.44,23.83 64.21,24.05 IC1.19 | v99.82,12.65 98.64,12.65 IC2.26
  Bottom 0.152: v64.44,23.67 64.44,23.44 64.16,23.16 64.16,19.51 64.92,18.74 67.36,18.74 69.19,16.92 69.19,15.24 69.8,14.63 78.49,14.63 80.16,12.95 80.16,10.52 81.38,9.3 82.3,9.3 82.45,9.14 84.28,9.14 84.73,8.69 100.28,8.69 100.89,9.3 100.89,12.34 100.74,12.5 99.97,12.5 v99.82,12.65
PF4  (via drill 0.25)
  Top 0.152: v100.25,16.51 100.48,16.28 100.48,16.26 100.58,16.15 101.5,16.15 101.96,15.7 101.96,13.11 102.41,12.65 110.4,12.65 IC2.29 | v65.2,23.22 64.9,23.22 64.75,23.06 64.14,23.06 63.68,23.52 61.33,23.52 IC1.20
  Bottom 0.152: v65.2,23.22 64.97,23.22 64.47,22.71 64.47,19.66 65.08,19.05 67.51,19.05 69.49,17.07 69.49,15.39 69.95,14.94 78.64,14.94 80.47,13.11 80.47,10.67 81.53,9.6 82.45,9.6 82.6,9.45 84.43,9.45 84.89,8.99 94.94,8.99 96.16,10.21 96.16,12.19 96.77,12.8 99.06,12.8 99.82,13.56 99.82,16.08 v100.25,16.51
PF5  (via drill 0.25)
  Top 0.152: v65.2,22.3 64.29,22.3 63.53,23.06 61.31,23.06 IC1.21 | v101.02,17.12 101.02,17.09 102.26,15.85 102.26,13.26 102.56,12.95 109.12,12.95 109.67,13.5 IC2.30
  Bottom 0.152: v65.2,22.3 65.2,22.23 64.77,21.79 64.77,19.81 65.23,19.35 67.67,19.35 69.8,17.22 69.8,15.54 70.1,15.24 78.79,15.24 80.77,13.26 80.77,10.82 81.69,9.91 82.6,9.91 82.75,9.75 84.58,9.75 85.04,9.3 94.79,9.3 95.86,10.36 95.86,12.34 96.62,13.11 98.91,13.11 99.52,13.72 99.52,16.76 99.97,17.22 100.91,17.22 v101.02,17.12
PF11  (via drill 0.25)
  Top 0.152: IC1.59 70.74,8.99 70.74,8.03 70.54,7.82 70.54,6.6 v70.59,6.55 | IC2.18 103.45,19.1 v103.63,18.92
  Bottom 0.152: v70.59,6.55 70.61,6.53 71.14,6.53 71.83,7.21 74.02,7.21 75.29,5.94 76.2,5.94 76.81,6.55 80.92,6.55 81.08,6.4 82.91,6.4 83.36,5.94 101.65,5.94 103.63,7.92 103.63,9.6 104.24,10.21 104.24,10.67 103.33,11.58 103.33,18.62 v103.63,18.92
PF12  (via drill 0.25)
  Top 0.152: IC1.60 71.3,7.62 v71.25,7.57 | IC2.31 111.61,14.3 111.61,14.28 112.01,13.87 112.01,11.13 111.56,10.67 103.76,10.67 v103.61,10.52
  Bottom 0.152: v71.25,7.57 71.3,7.52 74.17,7.52 75.44,6.25 76.05,6.25 76.66,6.86 81.08,6.86 81.23,6.71 83.06,6.71 83.52,6.25 101.5,6.25 103.33,8.08 103.33,10.24 v103.61,10.52
PF13  (via drill 0.25)
  Top 0.152: IC2.32 108.6,15.1 v108.33,14.83 | IC1.63 72.82,9.03 72.82,2.92 74.07,1.68 76.96,1.68 77.88,2.59 77.88,4.29 v77.85,4.32
  Bottom 0.152: v108.33,14.83 108.33,14.3 106.07,12.04 106.07,9.3 105.46,8.69 105.46,7.01 102.56,4.12 82.45,4.12 81.99,4.57 80.01,4.57 79.86,4.72 78.26,4.72 v77.85,4.32
PF14  (via drill 0.25)
  Top 0.152: IC2.33 108.79,15.9 v108.64,15.75 | IC1.64 73.28,9.03 73.28,7.75 73.15,7.62 73.15,3.05 74.22,1.98 76.81,1.98 77.27,2.44 77.27,3.38 v77.24,3.4
  Bottom 0.152: v108.64,15.75 108.1,15.75 107.75,15.39 107.75,14.17 105.77,12.19 105.77,9.45 105.16,8.84 105.16,7.16 102.41,4.42 82.6,4.42 82.14,4.88 80.31,4.88 80.16,5.03 77.57,5.03 77.24,4.7 v77.24,3.4
PF15  (via drill 0.25)  (1 unrouted)
  Top 0.152: IC2.34 108.37,16.7 v108.03,16.36 | IC1.65 73.81,9.04 73.81,7.82 73.46,7.47 73.46,3.2 74.37,2.29 76.35,2.29 76.66,2.59 76.66,2.77 v76.63,2.79
  Bottom 0.152: v108.03,16.36 108.03,16.13 107.44,15.54 107.44,14.33 105.46,12.34 105.46,9.6 104.85,8.99 104.85,7.31 102.26,4.72 82.75,4.72 82.3,5.18 80.47,5.18 80.31,5.33 77.42,5.33 76.5,4.42 76.5,2.92
PG0  (via drill 0.25)
  Top 0.152: IC1.66 74.35,9 74.35,7.9 73.76,7.31 73.76,4.14 v74.35,3.56 | v104.22,11.94 103.81,12.34 102.26,12.34 101.65,12.95 101.65,15.54 101.35,15.85 98.91,15.85 98.86,15.9 IC2.22
  Bottom 0.152: v74.35,3.56 74.4,3.51 75.44,3.51 75.89,3.96 75.89,4.72 77.11,5.94 80.62,5.94 80.77,5.79 82.6,5.79 83.06,5.33 101.96,5.33 104.24,7.62 104.24,9.3 104.85,9.91 104.85,10.97 104.39,11.43 104.39,11.76 v104.22,11.94
PG1  (via drill 0.25)
  Top 0.152: IC2.35 108.25,17.5 v108.03,17.27 | IC1.67 74.8,7.9 74.07,7.16 74.07,4.72 75.13,3.66 75.13,2.9 v75.11,2.87
  Bottom 0.152: v75.11,2.87 75.87,2.87 76.2,3.2 76.2,4.57 77.27,5.64 80.47,5.64 80.62,5.49 82.45,5.49 82.91,5.03 102.11,5.03 104.55,7.47 104.55,9.14 105.16,9.75 105.16,12.5 107.14,14.48 107.14,15.7 107.44,16 107.44,16.69 v108.03,17.27
PG4  (via drill 0.25)
  Top 0.152: IC2.20 97.43,17.5 v97.21,17.73 | v86.54,21.08 87.77,21.08 IC1.108
  Bottom 0.152: v97.21,17.73 96.93,17.45 96.93,16.31 97.23,16 97.23,14.48 96.77,14.02 96.16,14.02 94.94,12.8 94.94,10.82 94.34,10.21 85.5,10.21 85.04,10.67 83.21,10.67 83.06,10.82 82.14,10.82 81.69,11.28 81.69,20.73 81.99,21.03 86.49,21.03 v86.54,21.08
PG5  (via drill 0.25)
  Top 0.152: IC2.21 97.55,16.7 v97.51,16.66 | IC1.109 87,21.54 86.84,21.69 86.84,21.84 v86.54,22.15
  Bottom 0.152: v97.51,16.66 97.51,14.3 96.93,13.72 96.32,13.72 95.25,12.65 95.25,10.67 94.49,9.91 85.34,9.91 84.89,10.36 83.06,10.36 82.91,10.52 81.99,10.52 81.38,11.13 81.38,20.88 81.84,21.34 85.72,21.34 v86.54,22.15
PG8  (via drill 0.25)
  Top 0.152: v85.78,23.06 87.79,23.06 IC1.112 | v101.02,18.19 101.14,18.19 101.19,18.14 105.77,18.14 107.59,19.96 110.39,19.96 IC2.38
  Bottom 0.152: v101.02,18.19 100.94,18.19 100.28,17.53 99.82,17.53 99.21,16.92 99.21,13.87 98.75,13.41 96.47,13.41 95.56,12.5 95.56,10.52 94.64,9.6 85.19,9.6 84.73,10.06 82.91,10.06 82.75,10.21 81.84,10.21 81.08,10.97 81.08,21.03 81.69,21.64 85.19,21.64 85.8,22.25 85.8,23.04 v85.78,23.06
PG15  (via drill 0.25)
  Top 0.152: IC2.17 96.25,19.9 v94.87,21.29 | v71.5,33.22 71.5,33.48 71.75,33.73 71.75,35.51 IC1.160
  Bottom 0.152: v94.87,21.29 94.87,22.48 95.25,22.86 95.25,33.07 94.34,33.98 86.41,33.98 85.19,35.2 76.96,35.2 75.74,33.98 72.26,33.98 v71.5,33.22
SCK3
  Top 0.152: IC1.139 82.3,53.49 80.16,55.63 65.08,55.63 64.47,55.02 U1.28